# Altium project RK_NVR_DEMO1_RK3588_LP4XD200P232SD8_V21_20211228.PrjPcb (part 1 of 19)
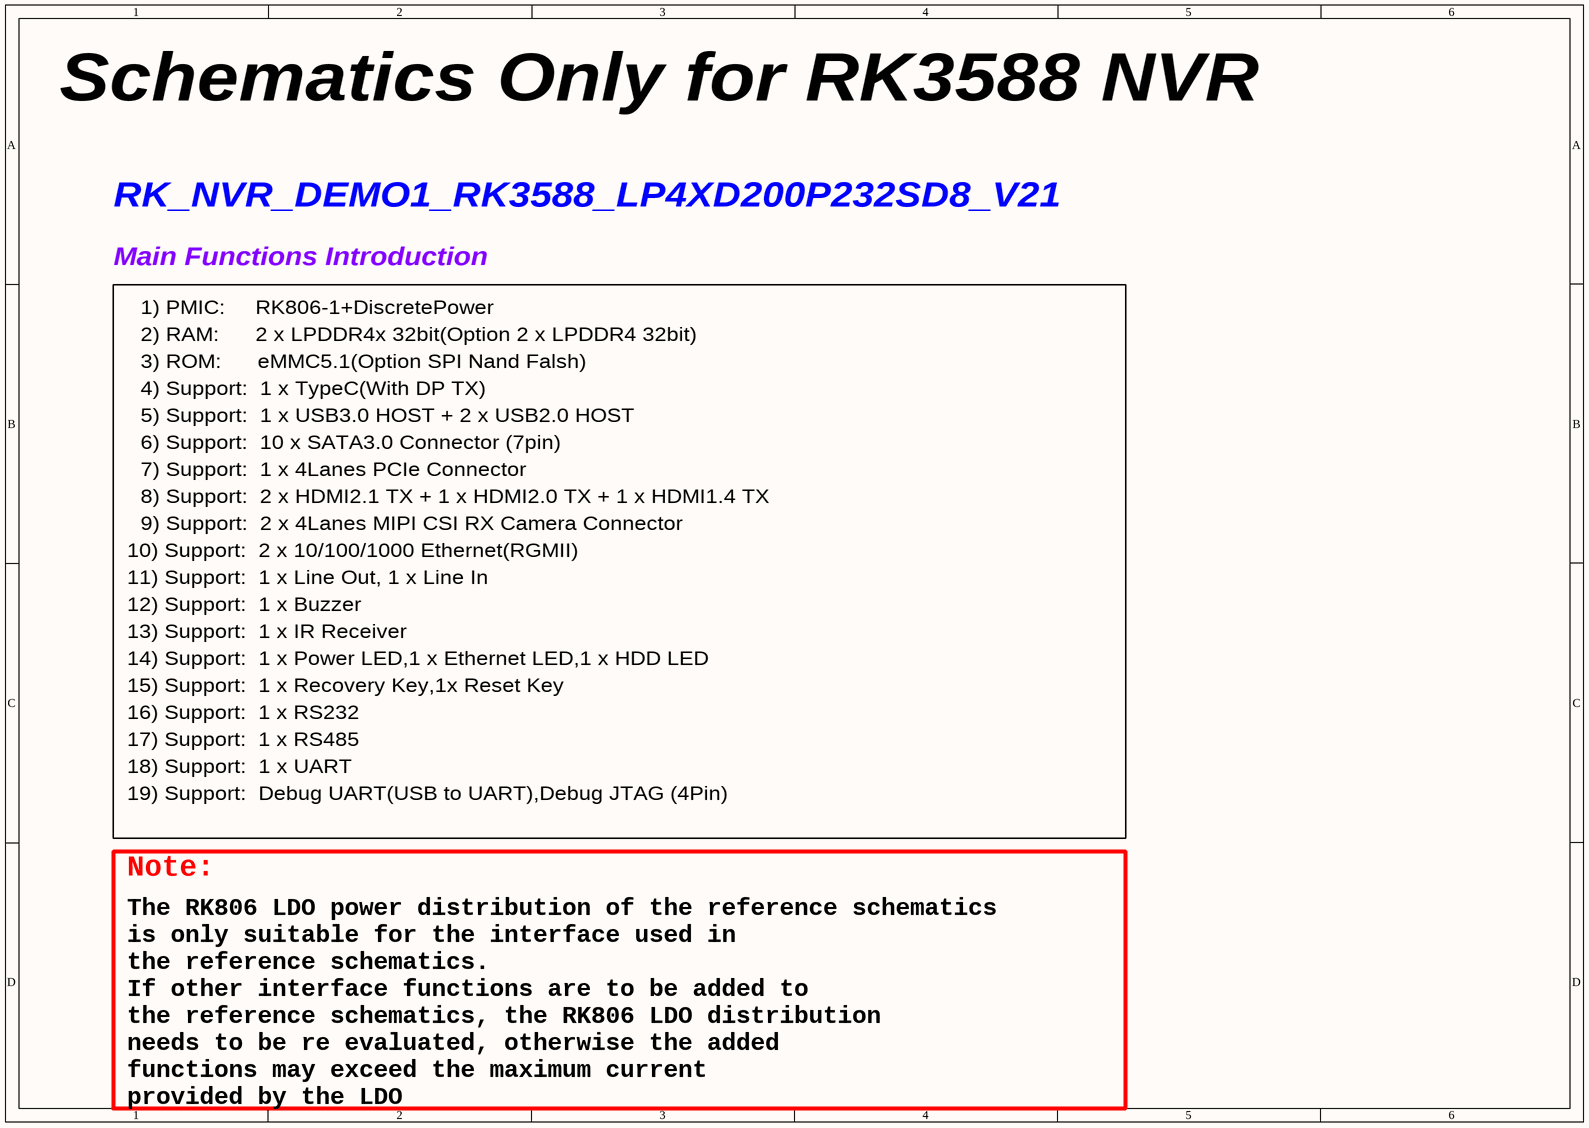
[diagram p0: 00.Cover Page.SchDoc]
42 sheets, 1582 parts. Net scope: global (net labels, ports and power ports of the same name join across sheets).
Board file: RK_NVR_DEMO1_RK3588_LP4XD200P232SD8_V21_20211228_final_lint.PcbDoc
Sheets:
  00.Cover Page.SchDoc
  01.Index and Notes.SchDoc
  02.Revision History.SchDoc
  03.Block Diagram.SchDoc
  04.Power Tree.SchDoc
  05.Power Sequence_IO Domain Map.SchDoc
  06.Lower-Speed Bus Map.SchDoc
  07.USB_DP Configure Map.SchDoc
  08.PCIE Fun Map.SchDoc
  11.RK3588_OSC_PLL_PMUIO.SchDoc
  12.RK3588 DDR Controler.SchDoc
  13.RK3588_Flash_SD Controller.SchDoc
  14.RK3588_USB30_USB20_Ctrl.SchDoc
  15.RK3588_SARADC_1.8V Only GPIO.SchDoc
  16.RK3588_MIPI  Interface.SchDoc
  17.RK3588_HDMI_eDP Interface.SchDoc
  18.RK3588_PCIE30_PCIE20_SATA30.SchDoc
  19.RK3588_1.8V_ 3.3V GPIO.SchDoc
  20.Power_DC IN.SchDoc
  21.Power-PMIC_RK806-1.SchDoc
  22.Power_Ext Discrete_RTC IC.SchDoc
  25.USB2_USB3_TypeC Port.SchDoc
  38.DRAM-LPDDR4X_200P_1X32bit.SchDoc
  40.Flash-eMMC Flash.SchDoc
  43.Flash-SPI FLASH(Option).SchDoc
  47.VI-Camera_MIPI-CSI.SchDoc
  50.VO-HDMI2.1 TX.SchDoc
  51.VO-HDMI2.0 TX(DP to HDMI).SchDoc
  55.VO-HDMI1.4 TX(MIPI to HDMI).SchDoc
  67.Ethernet-GEPHY_RGMII0.SchDoc
  68.Ethernet-GEPHY_RGMII1.SchDoc
  70.Audio Port.SchDoc
  82.SATA-SATA PM0.SchDoc
  83.SATA-SATA PM1.SchDoc
  84.PCIE-PCIE3.0_1x4Lanes_RC_64P.SchDoc
  90.IR Receiver_LED.SchDoc
  91.Debug UART_JTAG.SchDoc
  92.KEY.SchDoc
  93.HW_ID.SchDoc
  95.RS485_RS232.SchDoc
  98.Power Test.SchDoc
  99.Mark_Hole_Heatsink.SchDoc

## Sheet 00.Cover Page.SchDoc
size 297 x 209 mm; Revision: V2.1; Schematic Page Number: 11; Page Number: 1; Check: Default; Schematic Name: RK_NVR_DEMO1_RK3588_LP4/4x_V21; Page Count: 43; Page name: 00.Cover Page; Designer: Zhangdz; Schematic Page Count: 99; Revcode: V2.1; DsnPath: E:\Work\SBER\RK3588_SOM\temp\RK_NVR_DEMO1_RK3588_LP4XD200P232SD8_V21_20211228.DSN; SchematicName: RK_NVR_DEMO1_RK3588_LP4/4x_V21; PageName: 00.Cover Page; PageSize: A4; TopSchematic: True

### Notes on the sheet
- Schematics Only for RK3588 NVR
- RK_NVR_DEMO1_RK3588_LP4XD200P232SD8_V21
- Main Functions Introduction
- 1) PMIC:     RK806-1+DiscretePower
- 2) RAM:      2 x LPDDR4x 32bit(Option 2 x LPDDR4 32bit)
- 3) ROM:      eMMC5.1(Option SPI Nand Falsh)
- 4) Support:  1 x TypeC(With DP TX)
- 5) Support:  1 x USB3.0 HOST + 2 x USB2.0 HOST
- 6) Support:  10 x SATA3.0 Connector (7pin)
- 9) Support:  2 x 4Lanes MIPI CSI RX Camera Connector
- 7) Support:  1 x 4Lanes PCIe Connector
- 8) Support:  2 x HDMI2.1 TX + 1 x HDMI2.0 TX + 1 x HDMI1.4 TX
- 10) Support:  2 x 10/100/1000 Ethernet(RGMII)
- 11) Support:  1 x Line Out, 1 x Line In
- 13) Support:  1 x IR Receiver
- 14) Support:  1 x Power LED,1 x Ethernet LED,1 x HDD LED
- 12) Support:  1 x Buzzer
- 15) Support:  1 x Recovery Key,1x Reset Key
- 16) Support:  1 x RS232
- 19) Support:  Debug UART(USB to UART),Debug JTAG (4Pin)
- 17) Support:  1 x RS485
- 18) Support:  1 x UART
- Note:
- The RK806 LDO power distribution of the reference schematics
  is only suitable for the interface used in
  the reference schematics.
  If other interface functions are to be added to
  the reference schematics, the RK806 LDO distribution
  needs to be re evaluated, otherwise the added
  functions may exceed the maximum current
  provided by the LDO

## Sheet 01.Index and Notes.SchDoc
size 420 x 297 mm; Revision: V2.1; Schematic Page Number: 11; Page Number: 2; Check: Default; Schematic Name: RK_NVR_DEMO1_RK3588_LP4/4x_V21; Page Count: 43; Page name: 01.Index and Notes; Designer: Zhangdz; Schematic Page Count: 99; Revcode: V2.1; DsnPath: E:\Work\SBER\RK3588_SOM\temp\RK_NVR_DEMO1_RK3588_LP4XD200P232SD8_V21_20211228.DSN; SchematicName: RK_NVR_DEMO1_RK3588_LP4/4x_V21; PageName: 01.Index and Notes; PageSize: A3; TopSchematic: True
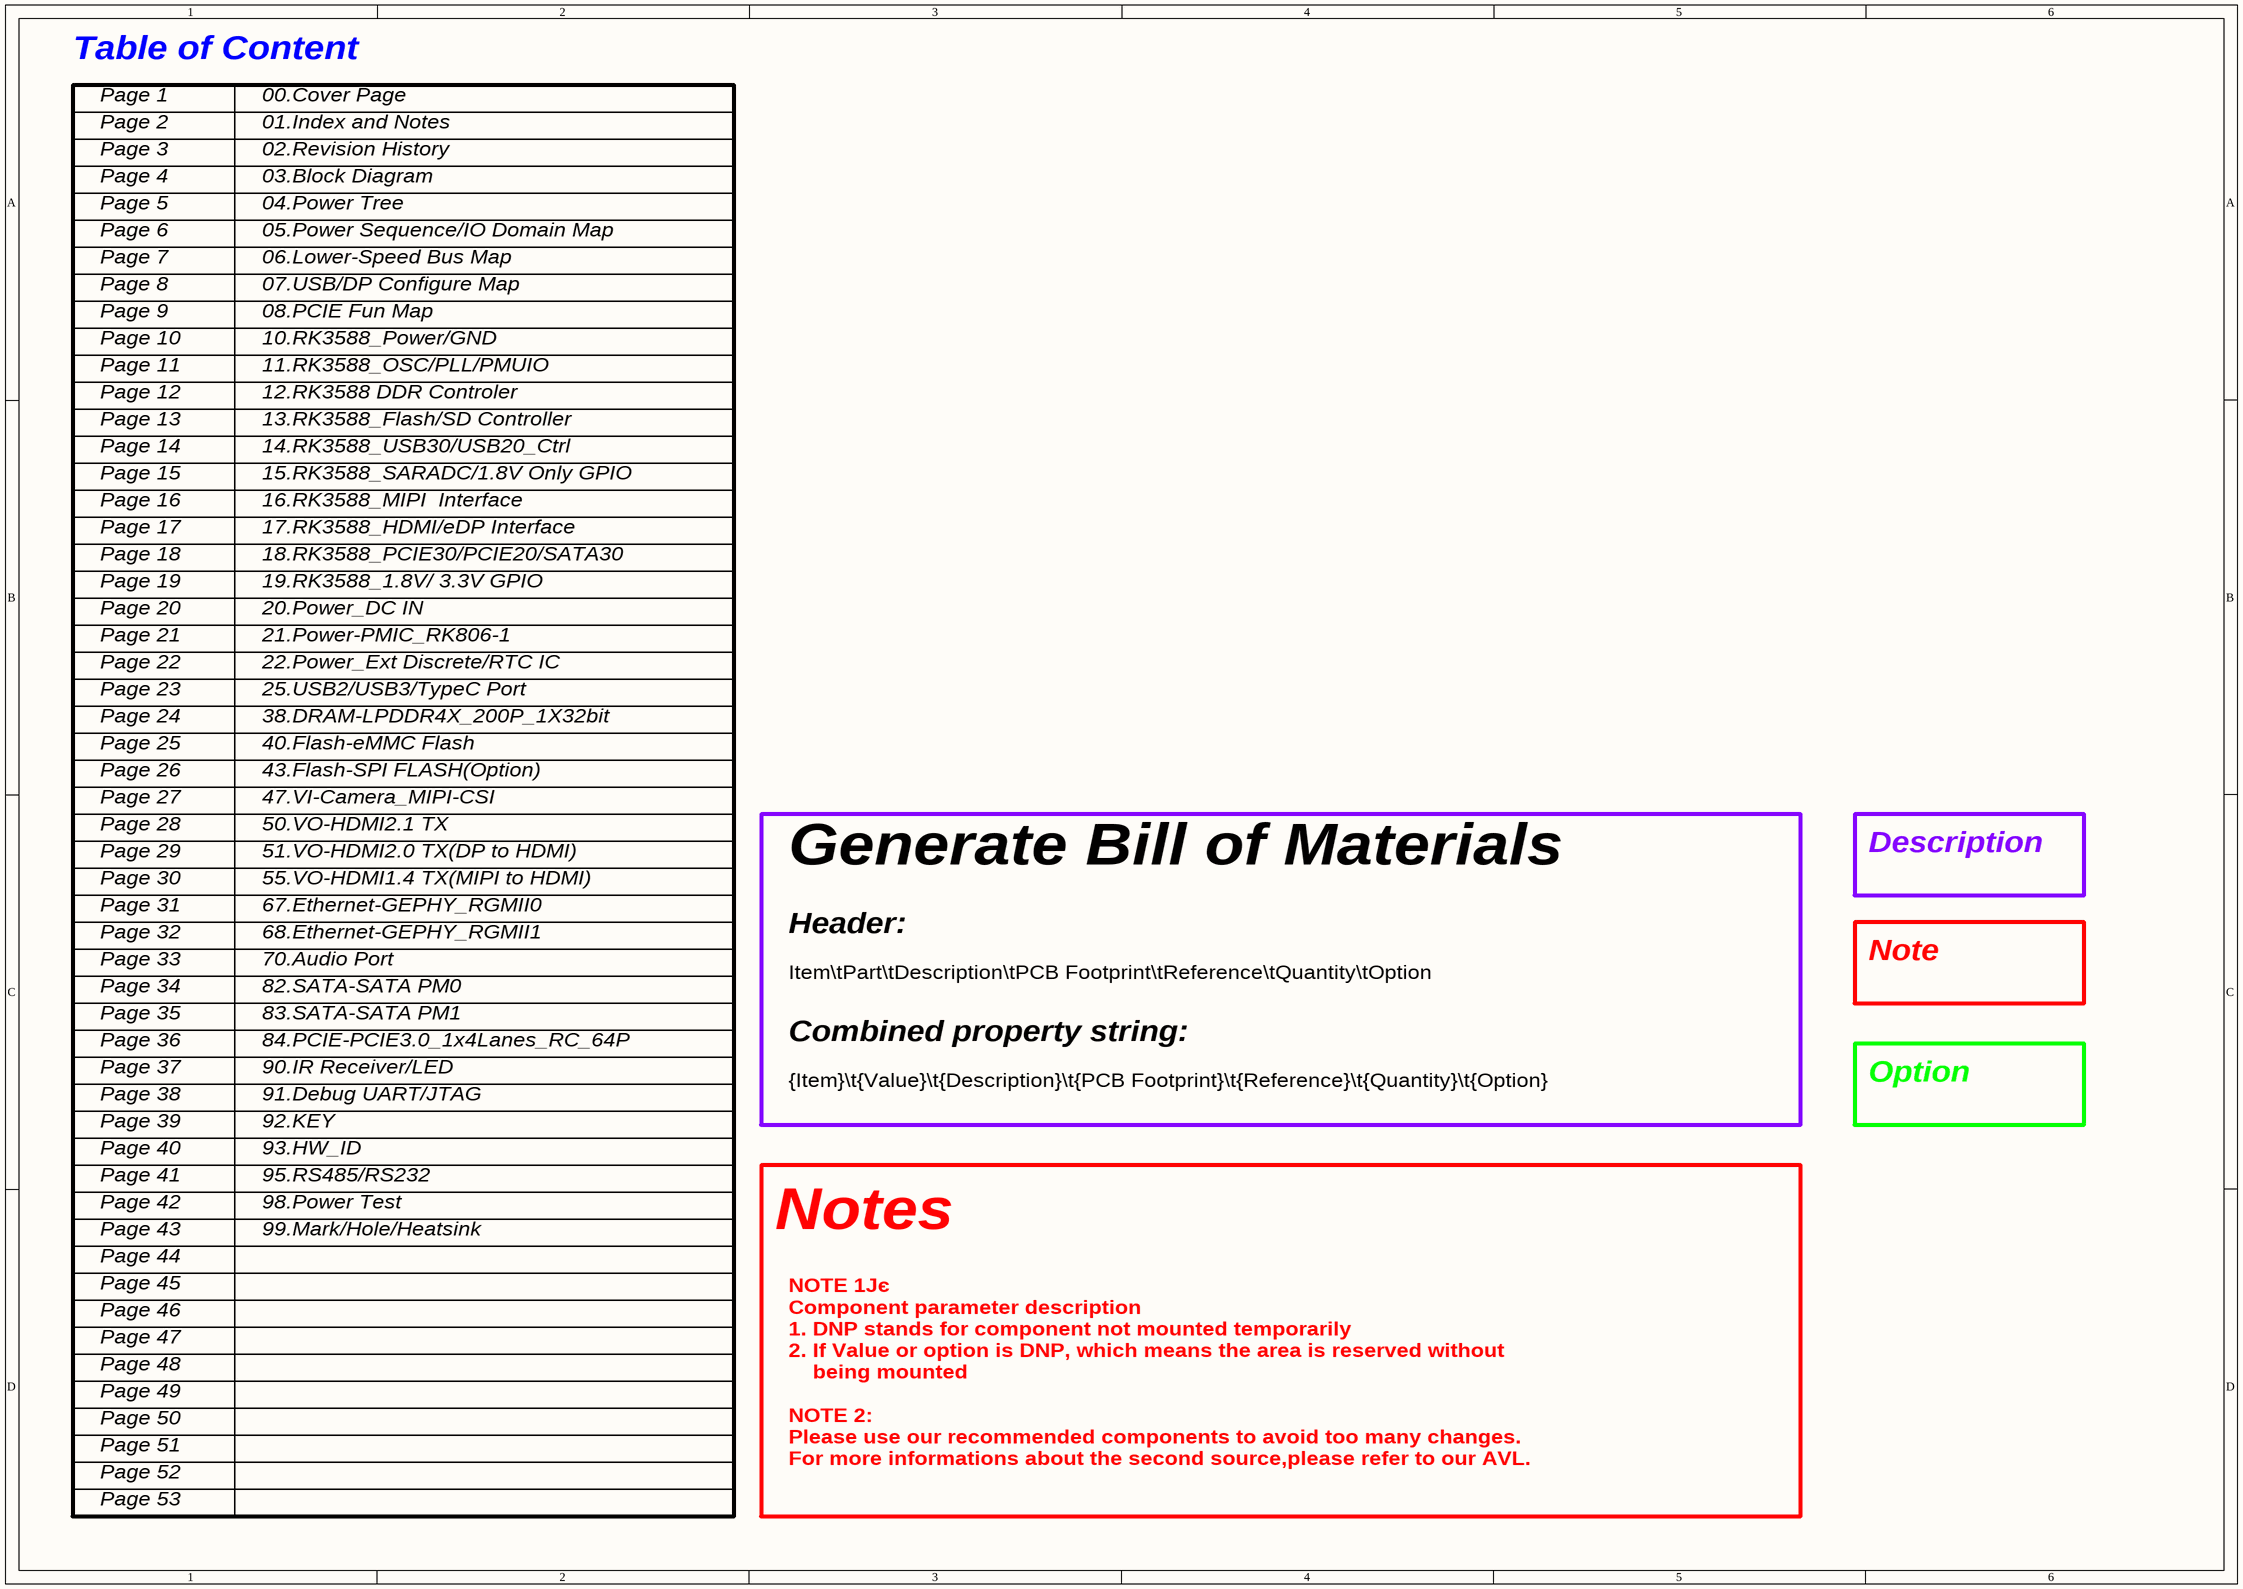
[diagram p1: 01.Index and Notes.SchDoc]

### Notes on the sheet
- Table of Content
- Page 1
- 00.Cover Page
- Page 2
- Page 3
- Page 4
- 01.Index and Notes
- 02.Revision History
- 03.Block Diagram
- Page 5
- Page 6
- 04.Power Tree
- 05.Power Sequence/IO Domain Map
- Page 7
- Page 8
- Page 9
- 06.Lower-Speed Bus Map
- 07.USB/DP Configure Map
- 08.PCIE Fun Map
- Page 10
- Page 11
- 10.RK3588_Power/GND
- 11.RK3588_OSC/PLL/PMUIO
- Page 12
- Page 13
- Page 14
- 13.RK3588_Flash/SD Controller
- 12.RK3588 DDR Controler
- 14.RK3588_USB30/USB20_Ctrl
- Page 15
- Page 16
- 15.RK3588_SARADC/1.8V Only GPIO
- 16.RK3588_MIPI  Interface
- Page 17
- Page 18
- Page 19
- 17.RK3588_HDMI/eDP Interface
- 18.RK3588_PCIE30/PCIE20/SATA30
- 19.RK3588_1.8V/ 3.3V GPIO
- Page 20
- Page 21
- 20.Power_DC IN
- 21.Power-PMIC_RK806-1
- Page 22
- Page 23
- Page 24
- 25.USB2/USB3/TypeC Port
- 38.DRAM-LPDDR4X_200P_1X32bit
- 22.Power_Ext Discrete/RTC IC
- Page 25
- Page 26
- 40.Flash-eMMC Flash
- 43.Flash-SPI FLASH(Option)
- Page 27
- Page 28
- Page 29
- 47.VI-Camera_MIPI-CSI
- 50.VO-HDMI2.1 TX
- 51.VO-HDMI2.0 TX(DP to HDMI)
- Description
- Page 30
- Page 31
- 55.VO-HDMI1.4 TX(MIPI to HDMI)
- 67.Ethernet-GEPHY_RGMII0
- Header:
- Generate Bill of Materials
- Page 32
- Page 33
- Page 34
- 70.Audio Port
- 68.Ethernet-GEPHY_RGMII1
- 82.SATA-SATA PM0
- Item\tPart\tDescription\tPCB Footprint\tReference\tQuantity\tOption
- Note
- Page 35
- Page 36
- 83.SATA-SATA PM1
- 84.PCIE-PCIE3.0_1x4Lanes_RC_64P
- Combined property string:
- Page 37
- Page 38
- Page 39
- 90.IR Receiver/LED
- 91.Debug UART/JTAG
- 92.KEY
- {Item}\t{Value}\t{Description}\t{PCB Footprint}\t{Reference}\t{Quantity}\t{Option}
- Option
- Page 40
- Page 41
- 95.RS485/RS232
- 93.HW_ID
- Page 42
- Page 43
- Page 44
- 99.Mark/Hole/Heatsink
- 98.Power Test
- Notes
- Page 45
- Page 46
- Page 47
- Page 48
- Page 49
- Page 50
- Page 51
- NOTE 1Јє
  Component parameter description
  1. DNP stands for component not mounted temporarily
  2. If Value or option is DNP, which means the area is reserved without
  being mounted
  NOTE 2:
  Please use our recommended components to avoid too many changes.
  For more informations about the second source,please refer to our AVL.
- Page 52
- Page 53

## Sheet 02.Revision History.SchDoc
size 297 x 209 mm; Revision: V2.1; Schematic Page Number: 11; Page Number: 3; Check: Default; Schematic Name: RK_NVR_DEMO1_RK3588_LP4/4x_V21; Page Count: 43; Page name: 02.Revision History; Designer: Zhangdz; Schematic Page Count: 99; Revcode: V2.1; DsnPath: E:\Work\SBER\RK3588_SOM\temp\RK_NVR_DEMO1_RK3588_LP4XD200P232SD8_V21_20211228.DSN; SchematicName: RK_NVR_DEMO1_RK3588_LP4/4x_V21; PageName: 02.Revision History; PageSize: A4; TopSchematic: True
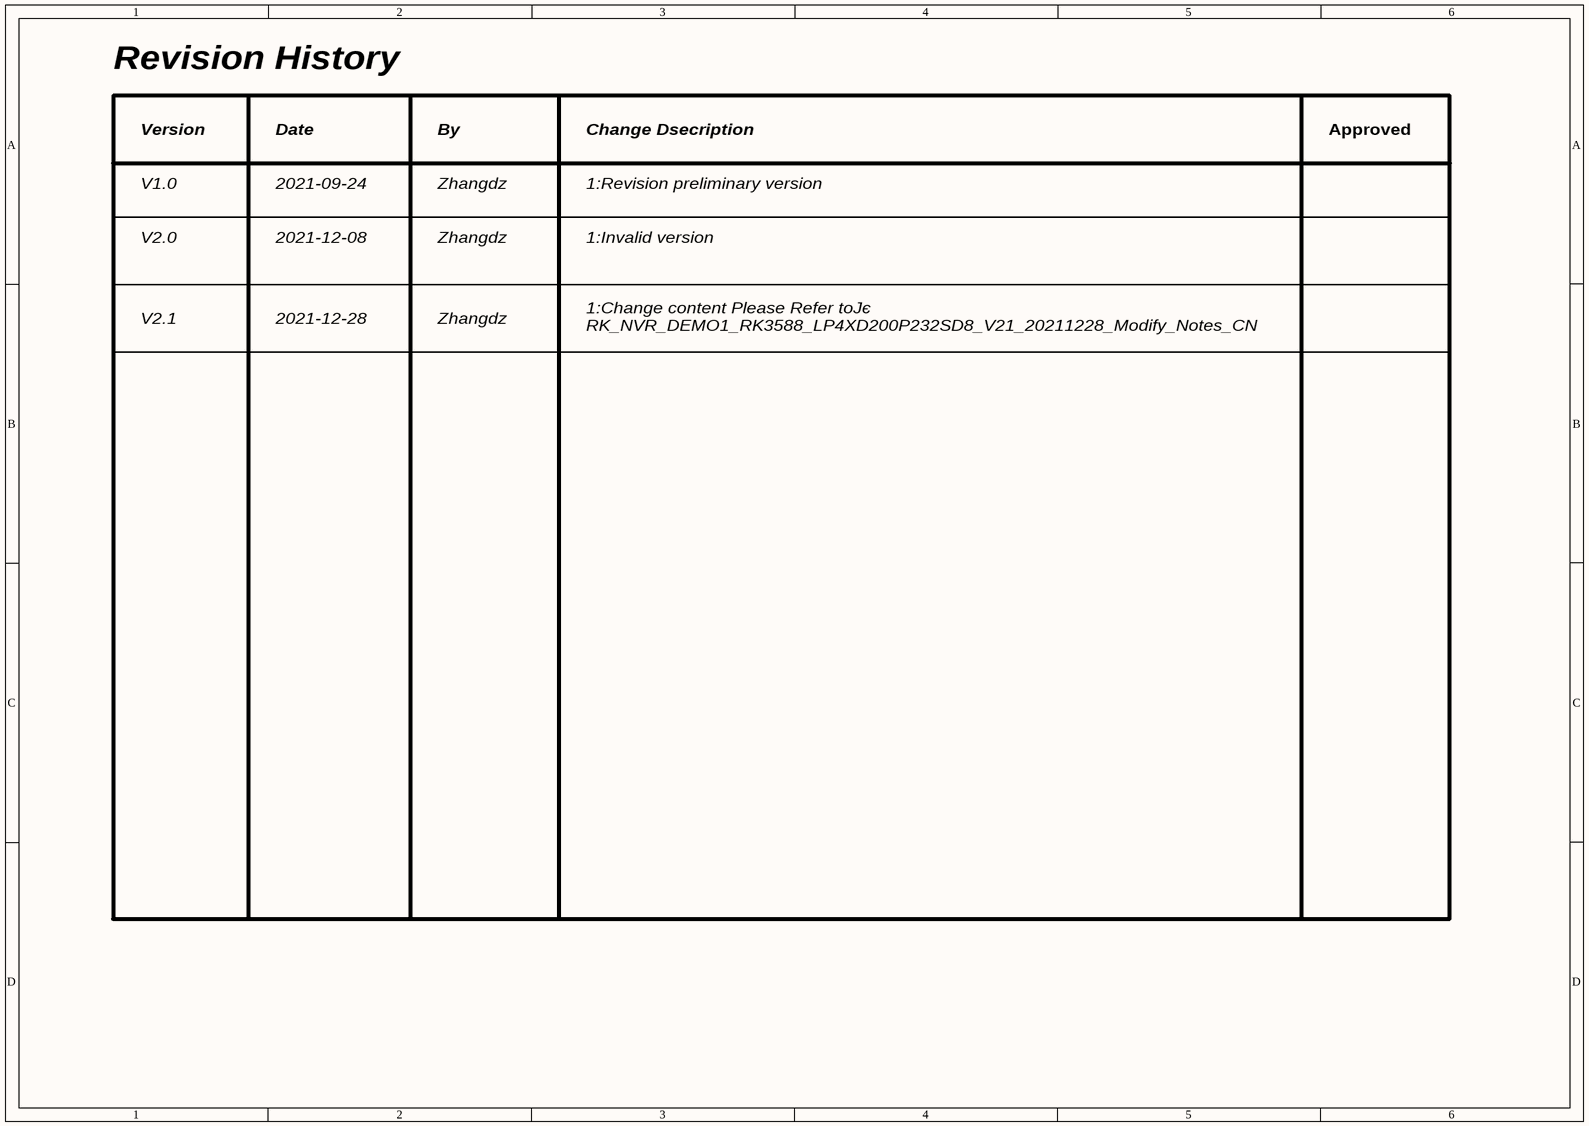
[diagram p2: 02.Revision History.SchDoc]

### Notes on the sheet
- Revision History
- Version
- Date
- By
- Change Dsecription
- Approved
- V1.0
- 2021-09-24
- Zhangdz
- 1:Revision preliminary version
- V2.0
- 2021-12-08
- 1:Invalid version
- V2.1
- 2021-12-28
- 1:Change content Please Refer toЈє
  RK_NVR_DEMO1_RK3588_LP4XD200P232SD8_V21_20211228_Modify_Notes_CN

## Sheet 03.Block Diagram.SchDoc
size 594 x 420 mm; Revision: V2.1; Schematic Page Number: 11; Page Number: 4; Check: Default; Schematic Name: RK_NVR_DEMO1_RK3588_LP4/4x_V21; Page Count: 43; Page name: 03.Block Diagram; Designer: Zhangdz; Schematic Page Count: 99; Revcode: V2.1; DsnPath: E:\Work\SBER\RK3588_SOM\temp\RK_NVR_DEMO1_RK3588_LP4XD200P232SD8_V21_20211228.DSN; SchematicName: RK_NVR_DEMO1_RK3588_LP4/4x_V21; PageName: 03.Block Diagram; PageSize: A2; TopSchematic: True
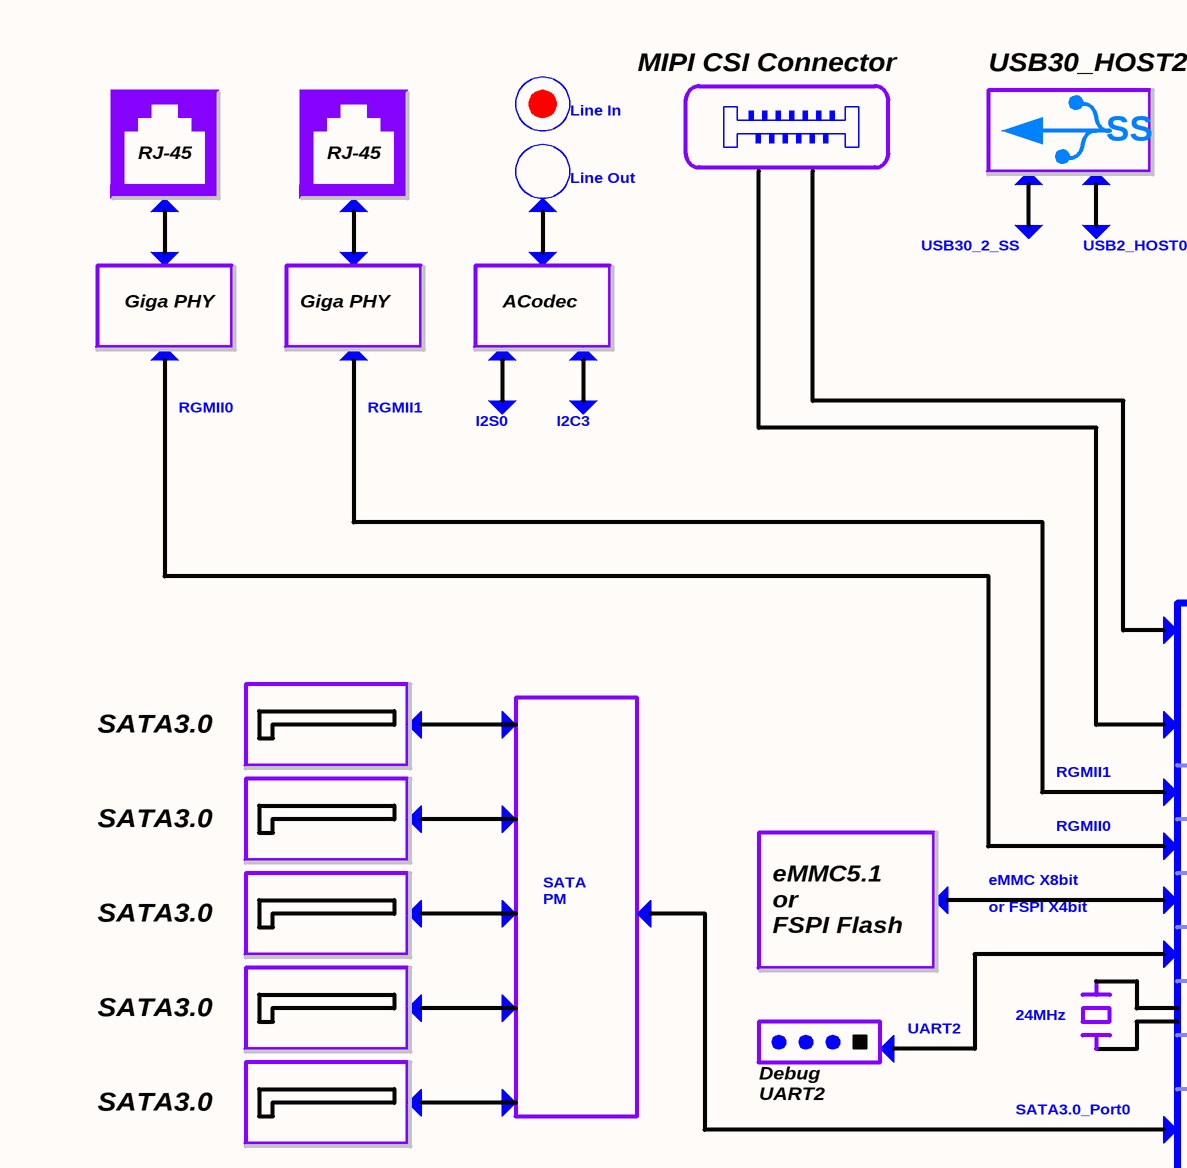
[diagram p3: 03.Block Diagram.SchDoc, top left]
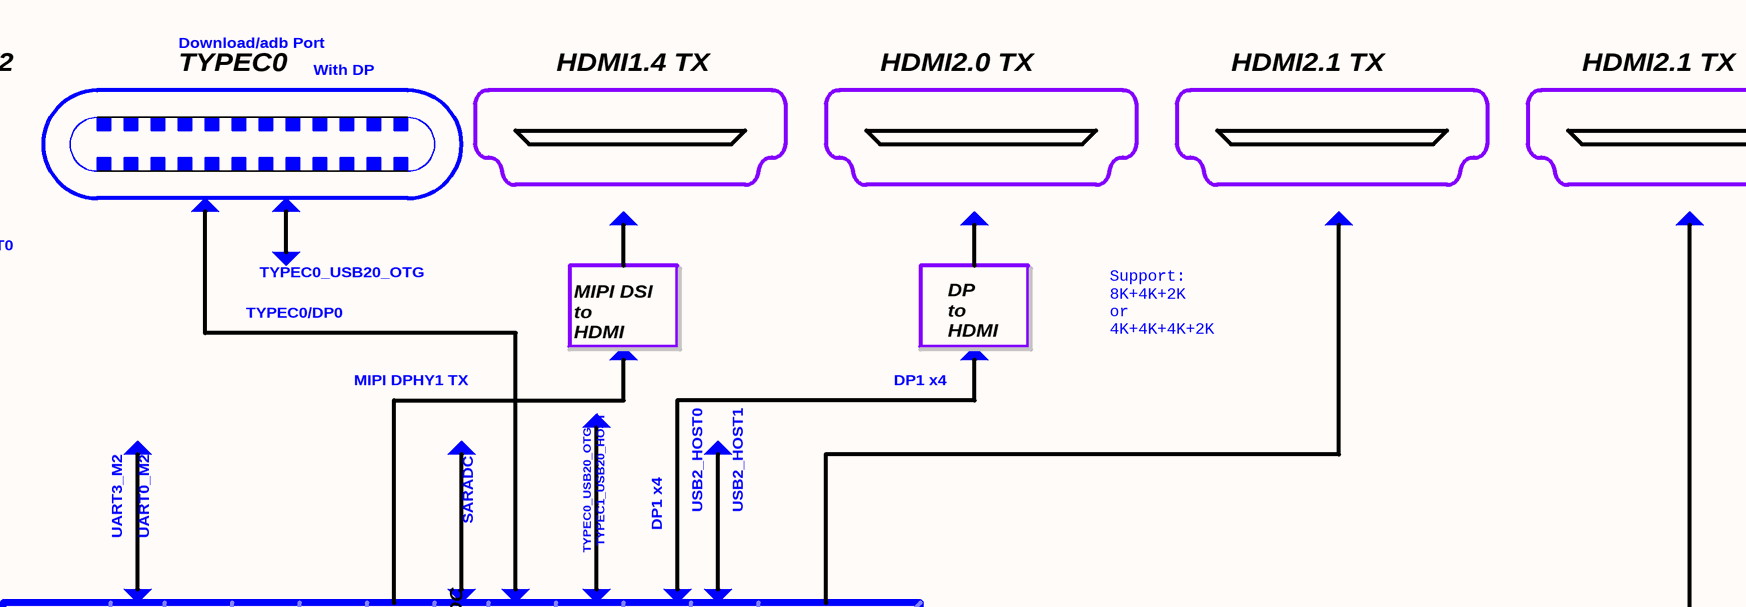
[diagram p4: 03.Block Diagram.SchDoc, top right]
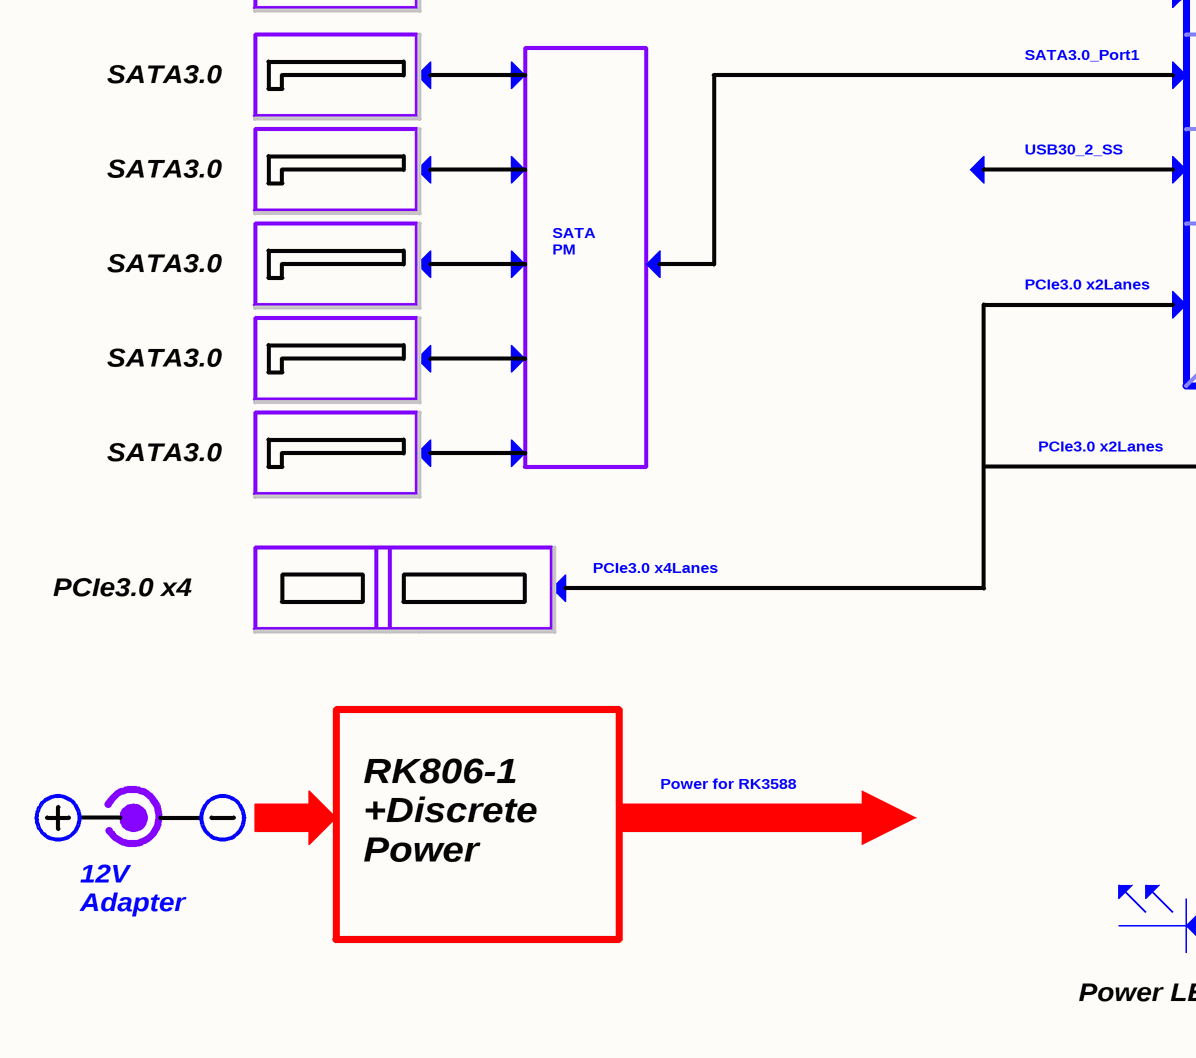
[diagram p5: 03.Block Diagram.SchDoc, bottom left]
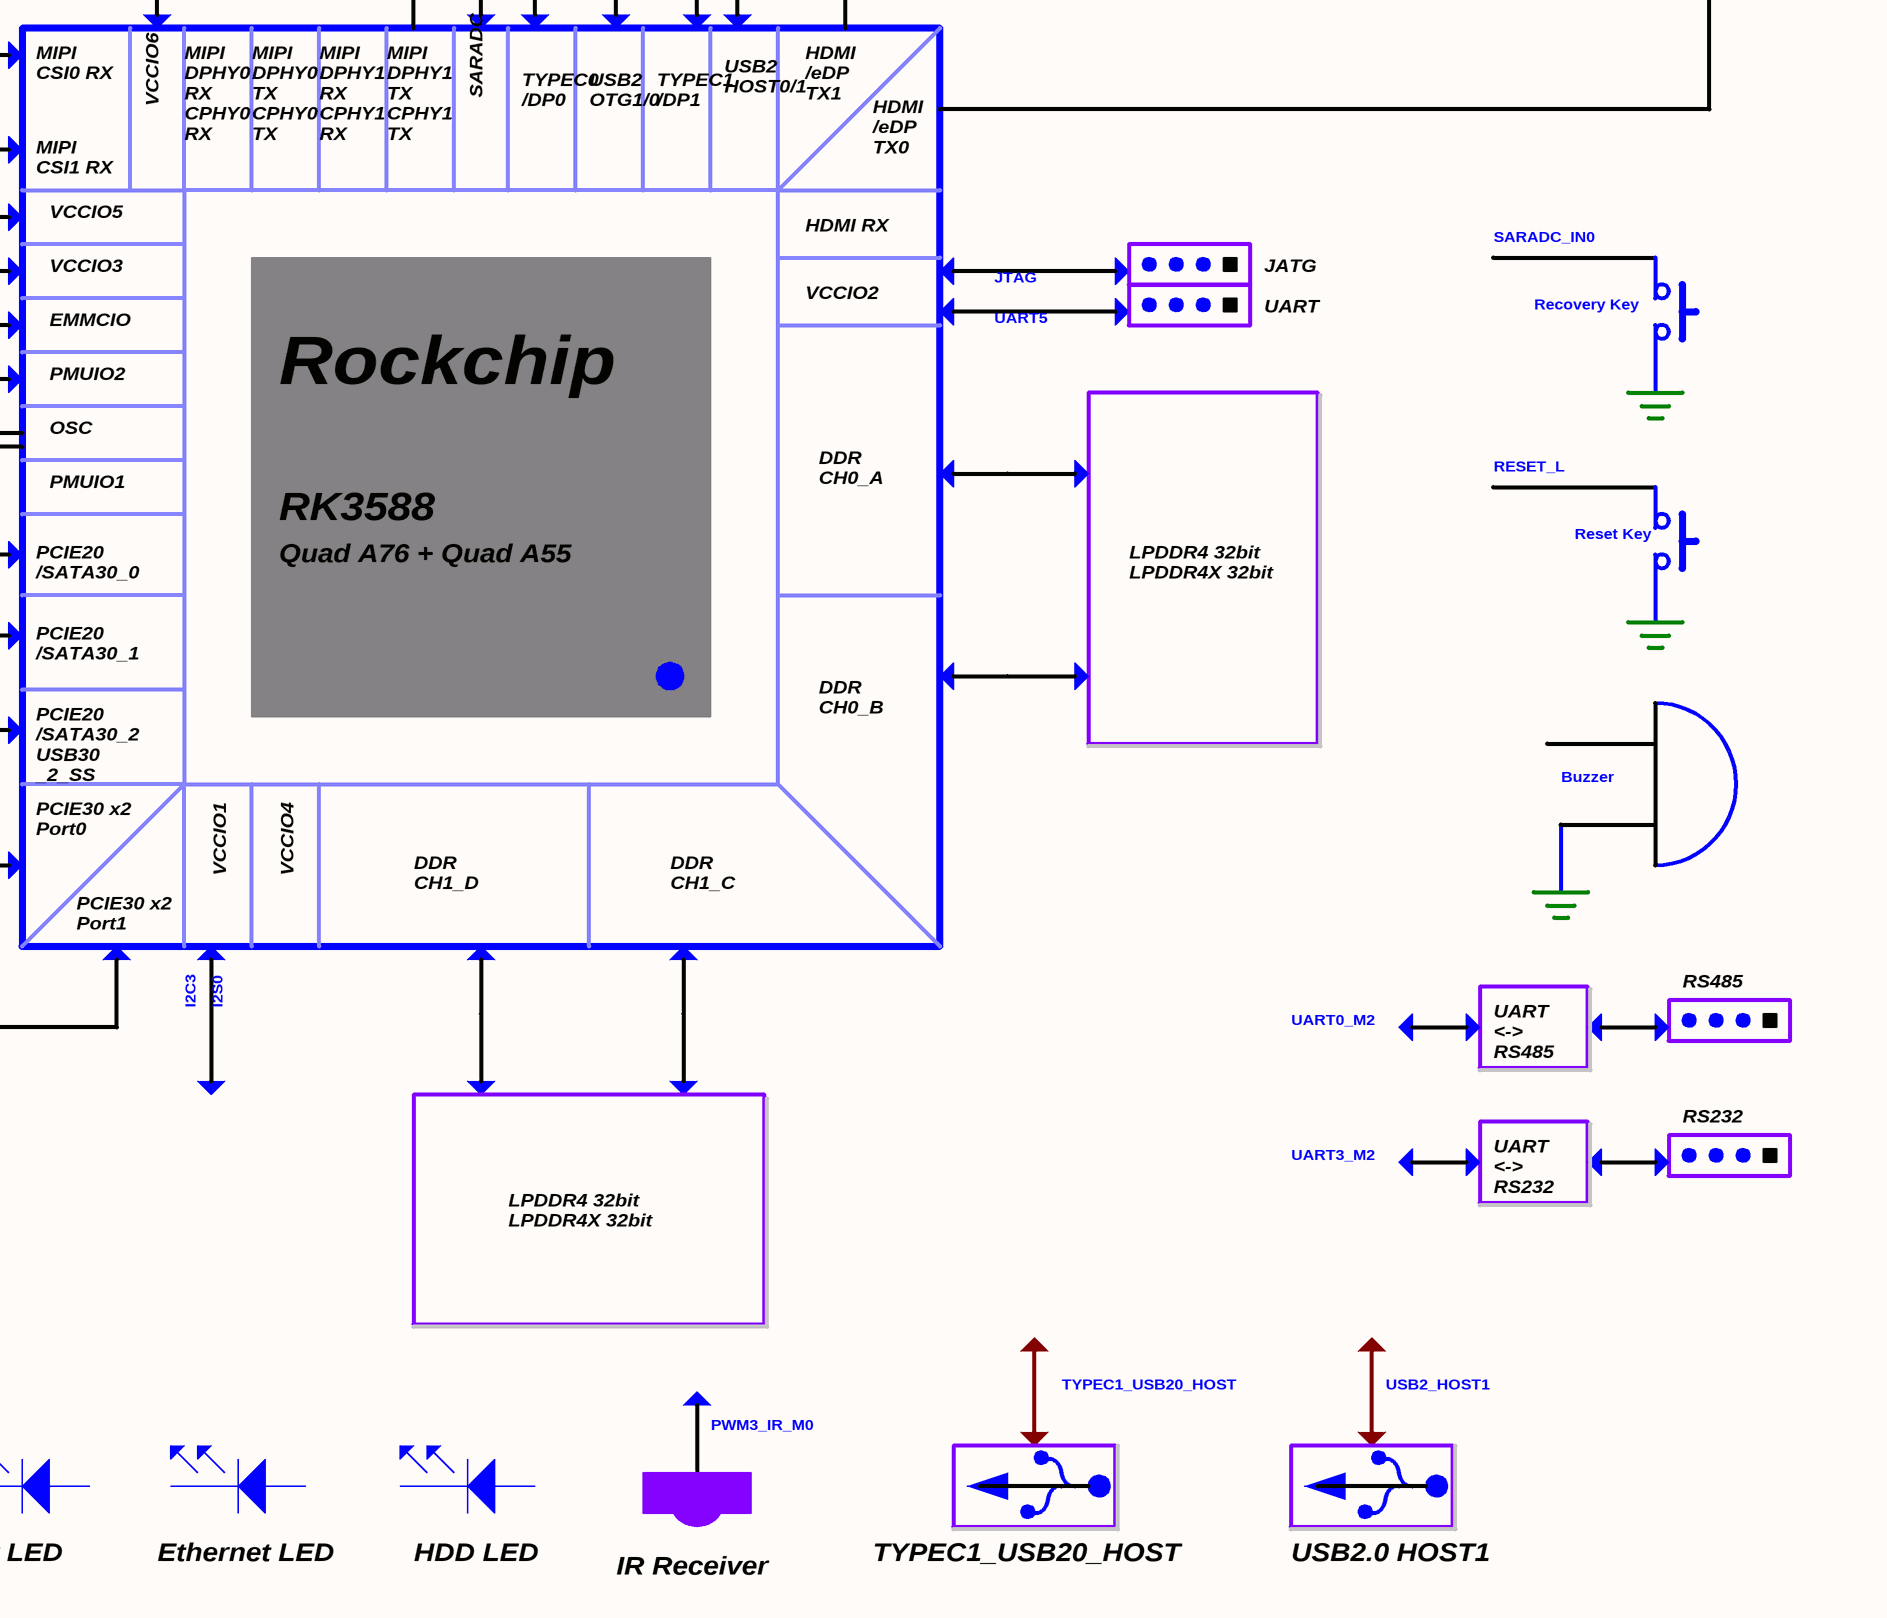
[diagram p6: 03.Block Diagram.SchDoc, bottom right]

### Notes on the sheet
- MIPI CSI Connector
- USB30_HOST2
- TYPEC0
- Download/adb Port
- With DP
- HDMI1.4 TX
- HDMI2.0 TX
- HDMI2.1 TX
- Line In
- SS
- RJ-45
- Line Out
- USB30_2_SS
- USB2_HOST0
- TYPEC0_USB20_OTG
- Giga PHY
- ACodec
- TYPEC0/DP0
- MIPI DSI
  to
  HDMI
- DP
  to
  HDMI
- Support:
  8K+4K+2K
  or
  4K+4K+4K+2K
- RGMII0
- RGMII1
- MIPI DPHY1 TX
- DP1 x4
- I2S0
- I2C3
- UART3_M2
- UART0_M2
- SARADC
- TYPEC1_USB20_HOST
- USB2_HOST1
- MIPI
  CSI0 RX
- VCCIO6
- HDMI
  /eDP
  TX1
- SATA3.0
- MIPI
  CSI1 RX
- MIPI
  DPHY0 RX
  CPHY0 RX
- MIPI
  DPHY0 TX
  CPHY0 TX
- MIPI
  DPHY1 RX
  CPHY1 RX
- MIPI
  DPHY1 TX
  CPHY1 TX
- TYPEC0
  /DP0
- USB2
  OTG1/0
- TYPEC1
  /DP1
- USB2
  HOST0/1
- HDMI
  /eDP
  TX0
- VCCIO5
- HDMI RX
- SARADC_IN0
- eMMC X8bit
- VCCIO3
- VCCIO2
- JTAG
- UART
- JATG
- Recovery Key
- SATA
  PM
- eMMC5.1
  or
  FSPI Flash
- or FSPI X4bit
- EMMCIO
- UART5
- 24MHz
- PMUIO2
- OSC
- Rockchip
- UART2
- PMUIO1
- DDR
  CH0_A
- RESET_L
- Debug
  UART2
- SATA3.0_Port0
- PCIE20
  /SATA30_0
- RK3588
- Quad A76 + Quad A55
- LPDDR4 32bit
  LPDDR4X 32bit
- Reset Key
- SATA3.0_Port1
- PCIE20
  /SATA30_1
- DDR
  CH0_B
- PCIE20
  /SATA30_2
  USB30
  _2_SS
- Buzzer
- PCIe3.0 x2Lanes
- PCIE30 x2
  Port0
- VCCIO1
- VCCIO4
- DDR
  CH1_D
- DDR
  CH1_C
- PCIE30 x2
  Port1
- RS485
- UART
  <->
  RS485
- RS232
- PCIe3.0 x4
- PCIe3.0 x4Lanes
- UART
  <->
  RS232
- Power for RK3588
- RK806-1
  +Discrete
  Power
- PWM3_IR_M0
- 12V
  Adapter
- Power LED
- Ethernet LED
- HDD LED
- IR Receiver
- USB2.0 HOST1

## Sheet 04.Power Tree.SchDoc
size 594 x 420 mm; Revision: V2.1; Schematic Page Number: 11; Page Number: 5; Check: Default; Schematic Name: RK_NVR_DEMO1_RK3588_LP4/4x_V21; Page Count: 43; Page name: 04.Power Tree; Designer: Zhangdz; Schematic Page Count: 99; Revcode: V2.1; DsnPath: E:\Work\SBER\RK3588_SOM\temp\RK_NVR_DEMO1_RK3588_LP4XD200P232SD8_V21_20211228.DSN; SchematicName: RK_NVR_DEMO1_RK3588_LP4/4x_V21; PageName: 04.Power Tree; PageSize: A2; TopSchematic: True
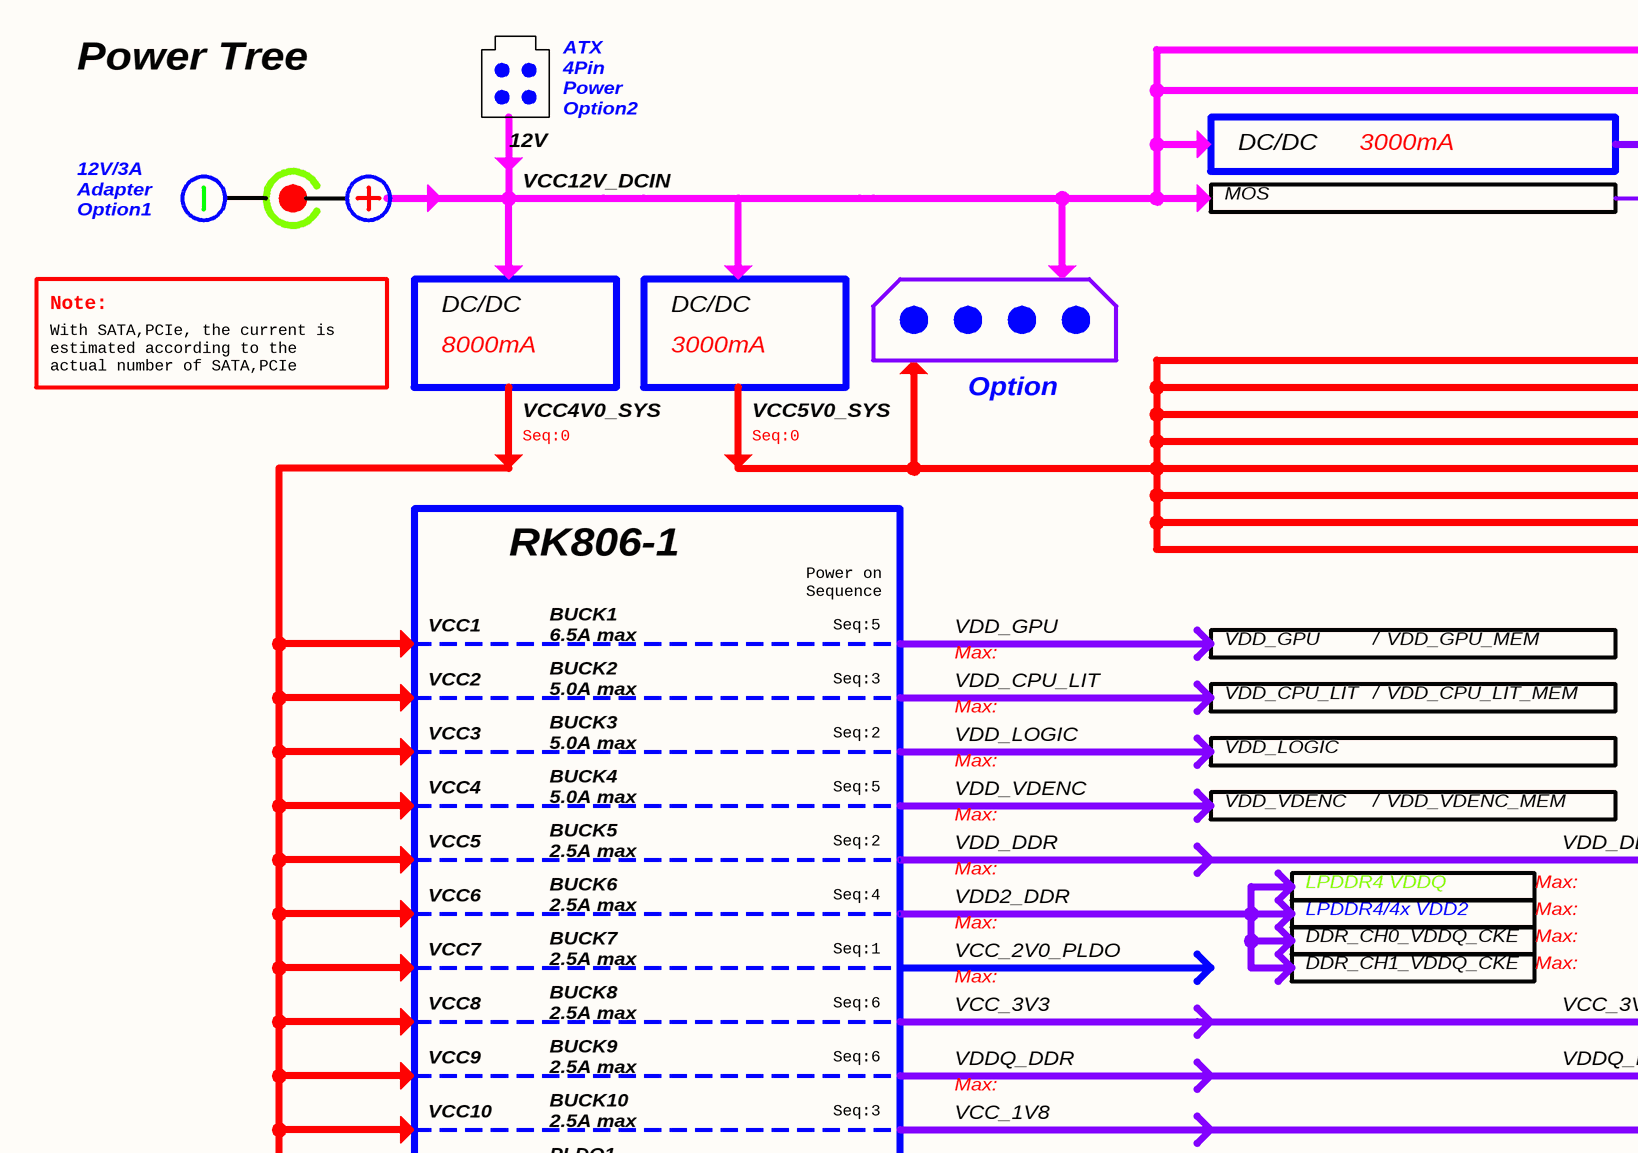
[diagram p7: 04.Power Tree.SchDoc, top left]
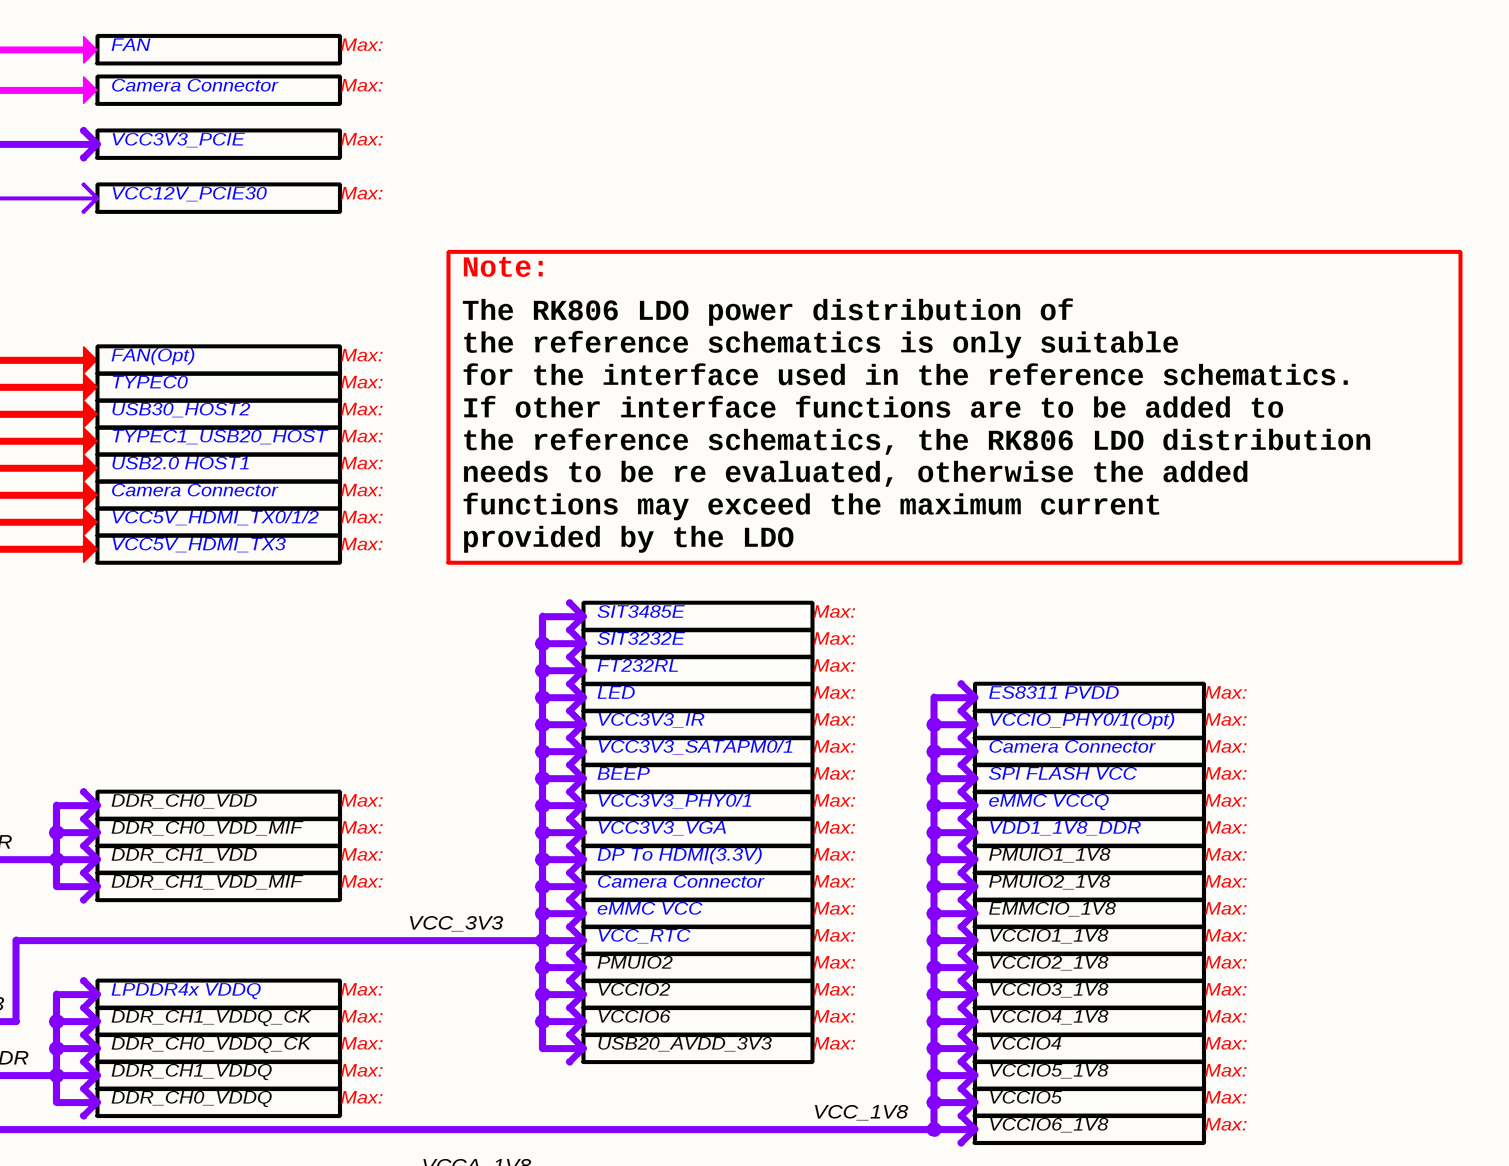
[diagram p8: 04.Power Tree.SchDoc, top right]
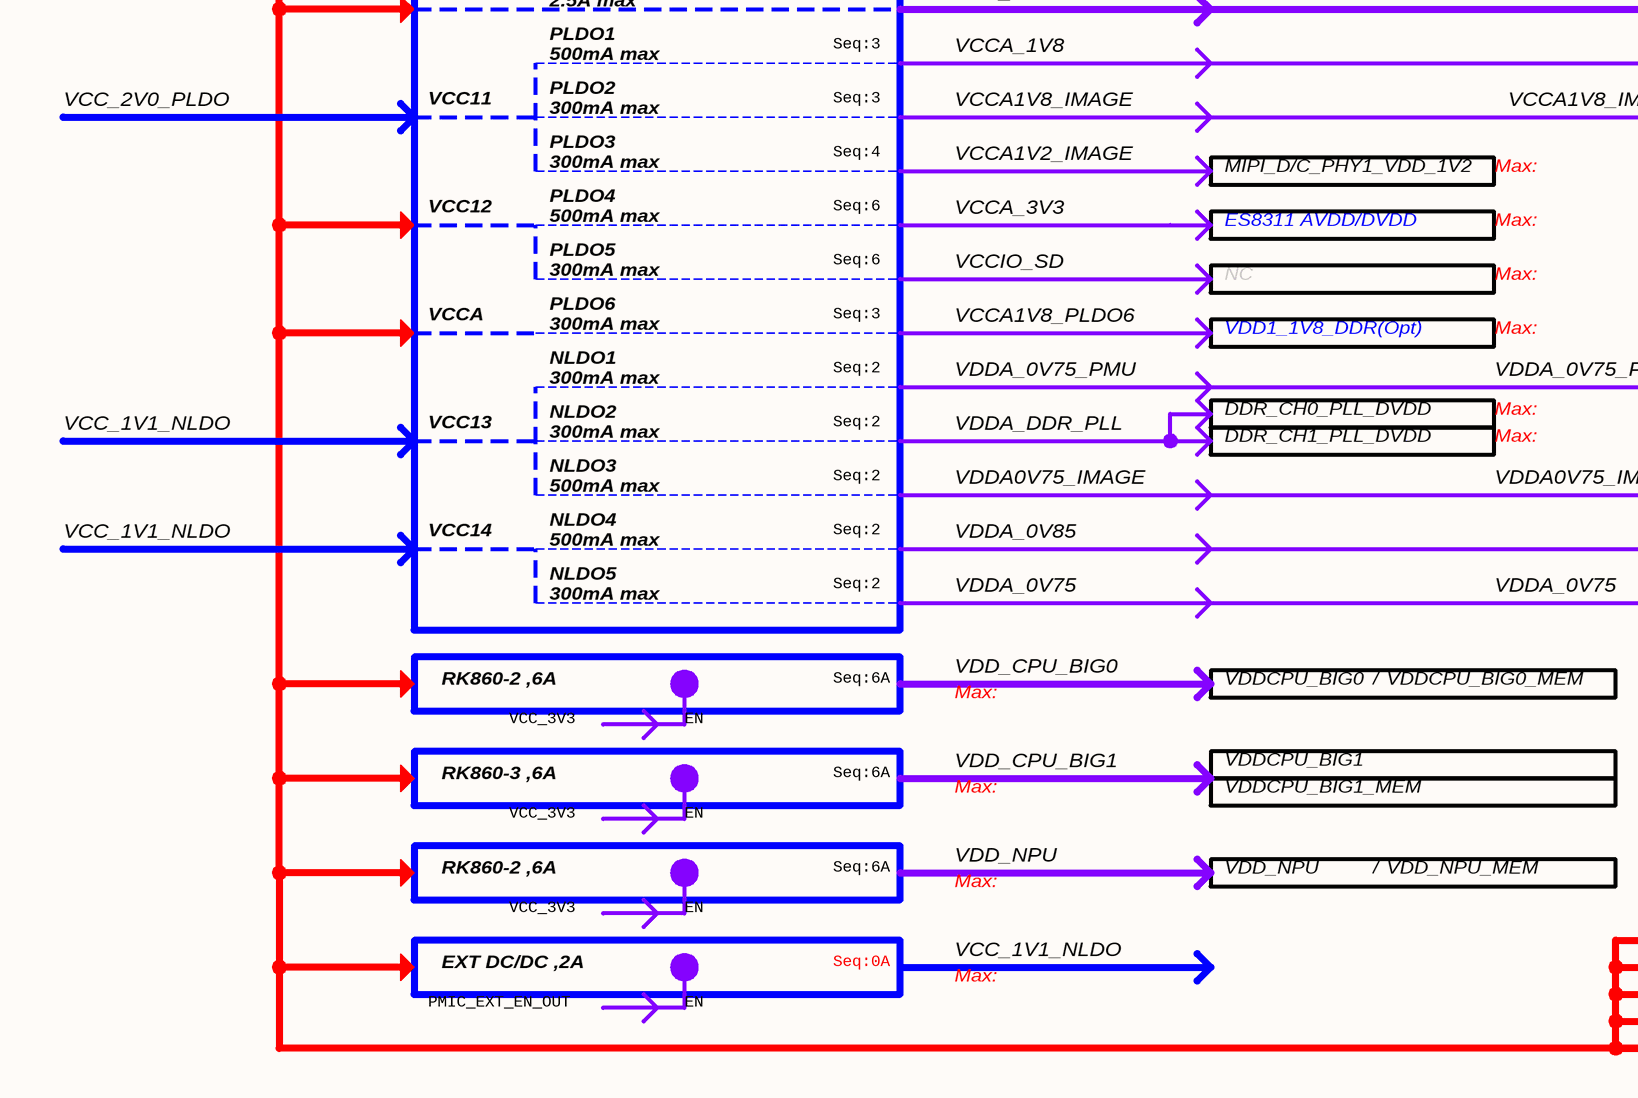
[diagram p9: 04.Power Tree.SchDoc, bottom left]
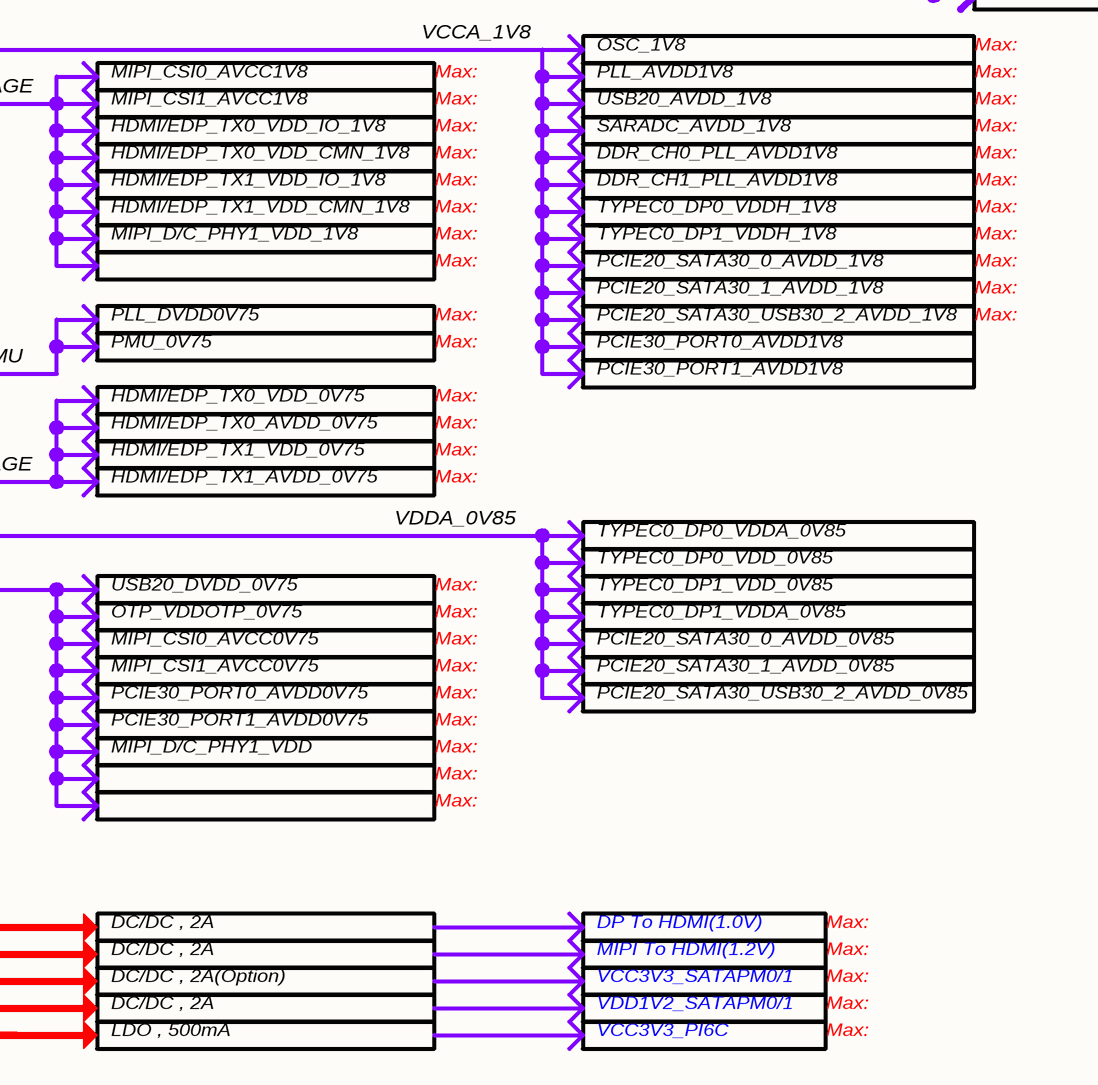
[diagram p10: 04.Power Tree.SchDoc, bottom right]

### Notes on the sheet
- Power Tree
- Camera Connector
- FAN
- Max:
- 12V
- ATX
  4Pin
  Power
  Option2
- DC/DC
- 3000mA
- VCC3V3_PCIE
- 12V/3A
  Adapter
  Option1
- VCC12V_DCIN
- MOS
- VCC12V_PCIE30
- Note:
- 8000mA
- FAN(Opt)
- With SATA,PCIe, the current is
  estimated according to the
  actual number of SATA,PCIe
- VCC4V0_SYS
- VCC5V0_SYS
- Option
- USB30_HOST2
- TYPEC0
- Seq:0
- USB2.0 HOST1
- TYPEC1_USB20_HOST
- RK806-1
- VCC5V_HDMI_TX0/1/2
- VCC5V_HDMI_TX3
- The RK806 LDO power distribution of
  the reference schematics is only suitable
  for the interface used in the reference schematics.
  If other interface functions are to be added to
  the reference schematics, the RK806 LDO distribution
  needs to be re evaluated, otherwise the added
  functions may exceed the maximum current
  provided by the LDO
- VCC1
- Power on
  Sequence
- Seq:5
- SIT3485E
- VCC2
- BUCK1
  6.5A max
- BUCK2
  5.0A max
- Seq:3
- VDD_CPU_LIT
- VDD_GPU
- /
- VDD_GPU_MEM
- FT232RL
- SIT3232E
- VCC3
- BUCK3
  5.0A max
- Seq:2
- VDD_LOGIC
- VDD_CPU_LIT_MEM
- VCC3V3_SATAPM0/1
- VCC3V3_IR
- LED
- VCCIO_PHY0/1(Opt)
- ES8311 PVDD
- VCC4
- BUCK4
  5.0A max
- VDD_VDENC
- VDD_VDENC_MEM
- DDR_CH0_VDD
- VCC3V3_PHY0/1
- BEEP
- eMMC VCCQ
- SPI FLASH VCC
- VCC5
- VCC6
- BUCK5
  2.5A max
- Seq:4
- VDD_DDR
- LPDDR4 VDDQ
- DDR_CH0_VDD_MIF
- DDR_CH1_VDD_MIF
- DDR_CH1_VDD
- DP To HDMI(3.3V)
- VCC3V3_VGA
- VDD1_1V8_DDR
- PMUIO1_1V8
- PMUIO2_1V8
- VCC7
- BUCK7
  2.5A max
- BUCK6
  2.5A max
- Seq:1
- VDD2_DDR
- VCC_2V0_PLDO
- DDR_CH0_VDDQ_CKE
- LPDDR4/4x VDD2
- VCC_3V3
- VCC_RTC
- eMMC VCC
- EMMCIO_1V8
- VCCIO1_1V8
- VCC8
- BUCK8
  2.5A max
- Seq:6
- DDR_CH1_VDDQ_CKE
- DDR_CH1_VDDQ_CK
- LPDDR4x VDDQ
- PMUIO2
- VCCIO2
- VCCIO6
- VCCIO2_1V8
- VCCIO3_1V8
- VCCIO4_1V8
- VCC9
- BUCK9
  2.5A max
- VDDQ_DDR
- DDR_CH0_VDDQ_CK
- DDR_CH1_VDDQ
- USB20_AVDD_3V3
- VCCIO5_1V8
- VCCIO4
- VCC10
- BUCK10
  2.5A max
- VCC_1V8
- DDR_CH0_VDDQ
- VCCIO5
- VCCIO6_1V8
- VCC11
- PLDO1
  500mA max
- PLDO2
  300mA max
- VCCA_1V8
- VCCA1V8_IMAGE
- MIPI_CSI0_AVCC1V8
- OSC_1V8
- PLL_AVDD1V8
- PLDO3
  300mA max
- VCCA1V2_IMAGE
- MIPI_D/C_PHY1_VDD_1V2
- MIPI_CSI1_AVCC1V8
- HDMI/EDP_TX0_VDD_IO_1V8
- HDMI/EDP_TX0_VDD_CMN_1V8
- DDR_CH0_PLL_AVDD1V8
- USB20_AVDD_1V8
- SARADC_AVDD_1V8
- VCC12
- PLDO4
  500mA max
- VCCA_3V3
- ES8311 AVDD/DVDD
- HDMI/EDP_TX1_VDD_IO_1V8
- HDMI/EDP_TX1_VDD_CMN_1V8
- DDR_CH1_PLL_AVDD1V8
- TYPEC0_DP0_VDDH_1V8
- VCCA
- PLDO5
  300mA max
- VCCIO_SD
- NC
- MIPI_D/C_PHY1_VDD_1V8
- TYPEC0_DP1_VDDH_1V8
- PCIE20_SATA30_0_AVDD_1V8
- PCIE20_SATA30_1_AVDD_1V8
- PLDO6
  300mA max
- NLDO1
  300mA max
- VDDA_0V75_PMU
- VCCA1V8_PLDO6
- VDD1_1V8_DDR(Opt)
- PLL_DVDD0V75
- PMU_0V75
- PCIE20_SATA30_USB30_2_AVDD_1V8
- PCIE30_PORT0_AVDD1V8
- VCC_1V1_NLDO
- VCC13
- NLDO2
  300mA max
- VDDA_DDR_PLL
- DDR_CH0_PLL_DVDD
- DDR_CH1_PLL_DVDD
- HDMI/EDP_TX0_VDD_0V75
- HDMI/EDP_TX0_AVDD_0V75
- PCIE30_PORT1_AVDD1V8
- NLDO3
  500mA max
- VDDA0V75_IMAGE
- HDMI/EDP_TX1_VDD_0V75
- HDMI/EDP_TX1_AVDD_0V75
- VCC14
- NLDO4
  500mA max
- VDDA_0V85
- TYPEC0_DP0_VDD_0V85
- TYPEC0_DP0_VDDA_0V85
- NLDO5
  300mA max
- VDDA_0V75
- USB20_DVDD_0V75
- OTP_VDDOTP_0V75
- TYPEC0_DP1_VDDA_0V85
- TYPEC0_DP1_VDD_0V85
- RK860-2 ,6A
- EN
- Seq:6A
- VDD_CPU_BIG0
- VDDCPU_BIG0
- VDDCPU_BIG0_MEM
- MIPI_CSI0_AVCC0V75
- MIPI_CSI1_AVCC0V75
- PCIE30_PORT0_AVDD0V75
- PCIE20_SATA30_0_AVDD_0V85
- PCIE20_SATA30_1_AVDD_0V85
- PCIE20_SATA30_USB30_2_AVDD_0V85
- RK860-3 ,6A
- VDD_CPU_BIG1
- VDDCPU_BIG1
- MIPI_D/C_PHY1_VDD
- PCIE30_PORT1_AVDD0V75
- VDDCPU_BIG1_MEM
- VDD_NPU
- VDD_NPU_MEM
- EXT DC/DC ,2A
- Seq:0A
- DC/DC , 2A(Option)
- DC/DC , 2A
- DP To HDMI(1.0V)
- MIPI To HDMI(1.2V)
- PMIC_EXT_EN_OUT
- LDO , 500mA
- VCC3V3_PI6C
- VDD1V2_SATAPM0/1

## Sheet 05.Power Sequence_IO Domain Map.SchDoc
size 420 x 297 mm; Revision: V2.1; Schematic Page Number: 11; Page Number: 6; Check: Default; Schematic Name: RK_NVR_DEMO1_RK3588_LP4/4x_V21; Page Count: 43; Page name: 05.Power Sequence/IO Domain Map; Designer: Zhangdz; Schematic Page Count: 99; Revcode: V2.1; DsnPath: E:\Work\SBER\RK3588_SOM\temp\RK_NVR_DEMO1_RK3588_LP4XD200P232SD8_V21_20211228.DSN; SchematicName: RK_NVR_DEMO1_RK3588_LP4/4x_V21; PageName: 05.Power Sequence/IO Domain Map; PageSize: A3; TopSchematic: True
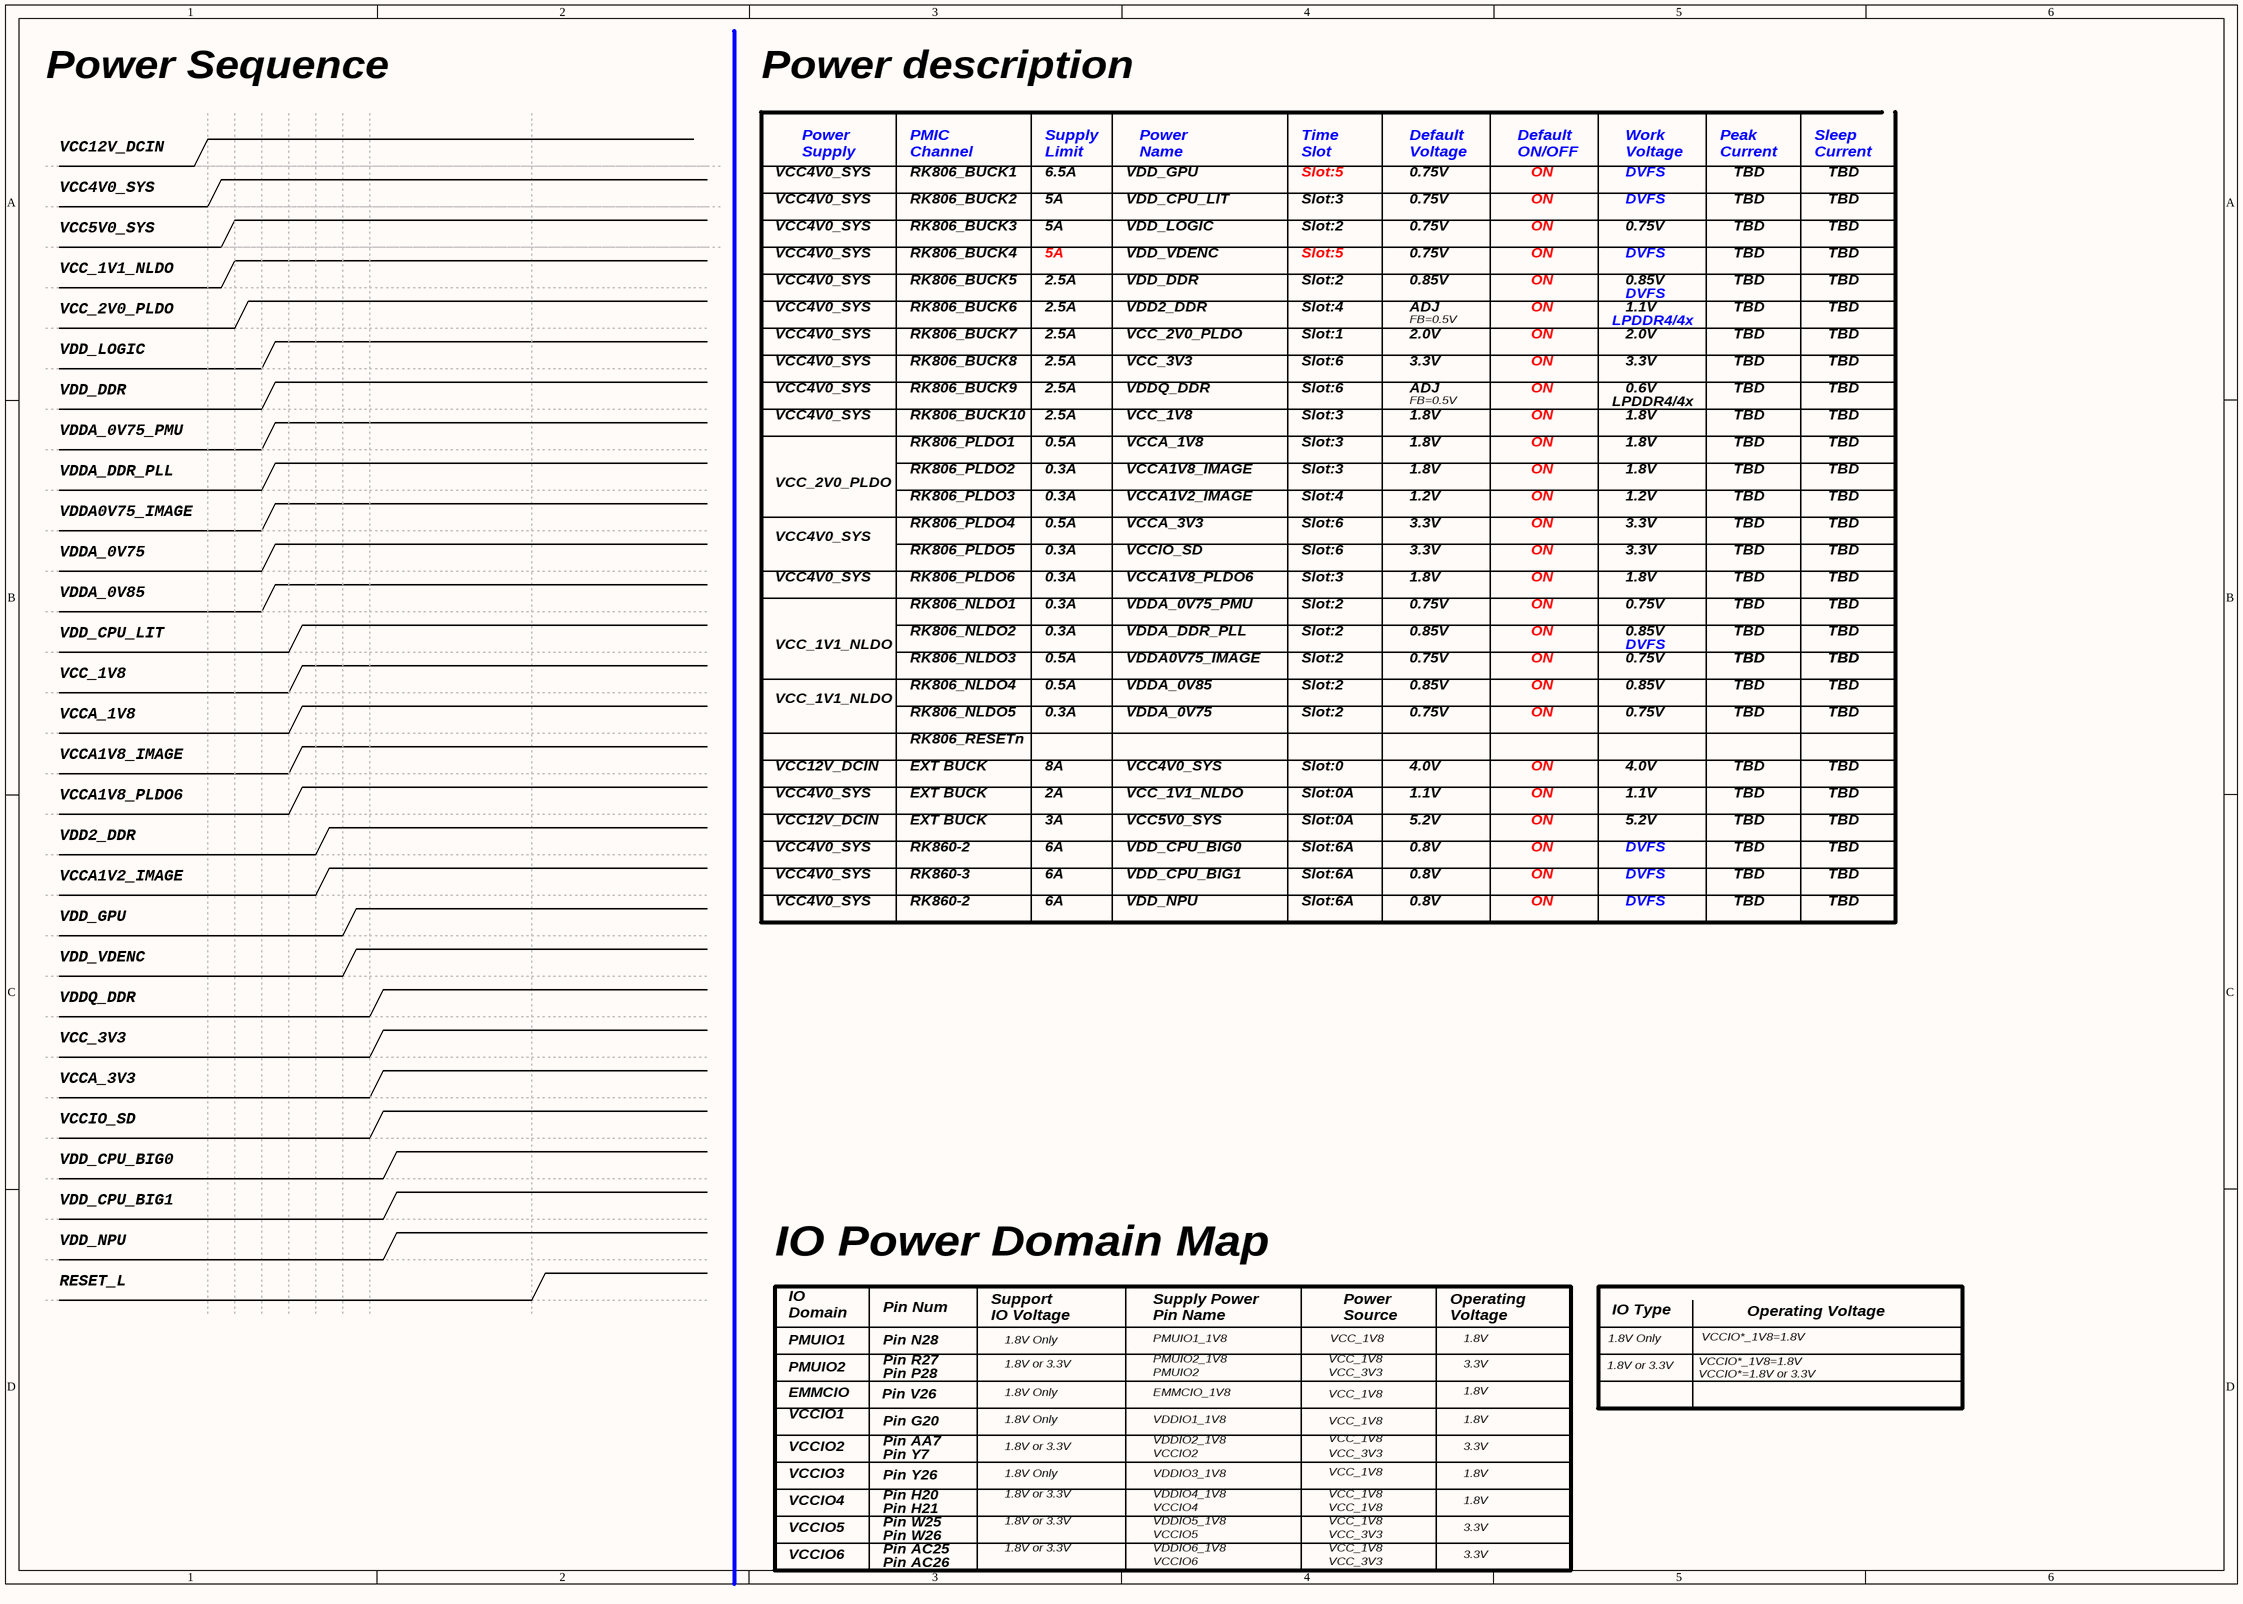
[diagram p11: 05.Power Sequence_IO Domain Map.SchDoc]

### Notes on the sheet
- Power Sequence
- Power description
- VCC4V0_SYS
- VCC12V_DCIN
- Power
  Supply
- PMIC
  Channel
- RK806_BUCK1
- Supply
  Limit
- 6.5A
- VDD_GPU
- Power
  Name
- Time
  Slot
- Slot:5
- Default
  Voltage
- 0.75V
- Default
  ON/OFF
- ON
- Work
  Voltage
- DVFS
- Peak
  Current
- TBD
- Sleep
  Current
- VCC5V0_SYS
- RK806_BUCK2
- RK806_BUCK3
- RK806_BUCK4
- 5A
- VDD_CPU_LIT
- VDD_LOGIC
- VDD_VDENC
- Slot:2
- Slot:3
- VCC_1V1_NLDO
- VCC_2V0_PLDO
- RK806_BUCK5
- RK806_BUCK6
- 2.5A
- VDD2_DDR
- VDD_DDR
- Slot:4
- 0.85V
- ADJ
- FB=0.5V
- LPDDR4/4x
- 1.1V
- RK806_BUCK7
- RK806_BUCK8
- RK806_BUCK9
- VCC_3V3
- VDDQ_DDR
- Slot:1
- Slot:6
- 2.0V
- 3.3V
- 0.6V
- VDDA_0V75_PMU
- RK806_BUCK10
- RK806_PLDO1
- 0.5A
- VCCA_1V8
- VCC_1V8
- 1.8V
- VDDA_DDR_PLL
- VDDA0V75_IMAGE
- RK806_PLDO2
- RK806_PLDO3
- RK806_PLDO4
- 0.3A
- VCCA1V2_IMAGE
- VCCA_3V3
- VCCA1V8_IMAGE
- 1.2V
- VDDA_0V75
- VDDA_0V85
- RK806_PLDO5
- RK806_PLDO6
- VCCA1V8_PLDO6
- VCCIO_SD
- RK806_NLDO3
- RK806_NLDO1
- RK806_NLDO2
- RK806_NLDO4
- RK806_NLDO5
- RK806_RESETn
- EXT BUCK
- 8A
- 2A
- Slot:0
- Slot:0A
- 4.0V
- RK860-2
- 3A
- 6A
- VDD_CPU_BIG0
- Slot:6A
- 5.2V
- 0.8V
- RK860-3
- VDD_CPU_BIG1
- VDD_NPU
- IO Power Domain Map
- RESET_L
- IO
  Domain
- Pin Num
- Support
  IO Voltage
- 1.8V Only
- Supply Power
  Pin Name
- PMUIO1_1V8
- Power
  Source
- Operating
  Voltage
- IO Type
- VCCIO*_1V8=1.8V
- Operating Voltage
- PMUIO1
- PMUIO2
- EMMCIO
- Pin V26
- Pin N28
- Pin R27
- Pin P28
- 1.8V or 3.3V
- PMUIO2_1V8
- EMMCIO_1V8
- VCCIO*_1V8=1.8V
  VCCIO*=1.8V or 3.3V
- VCCIO1
- VCCIO2
- VCCIO3
- Pin Y7
- Pin AA7
- Pin G20
- VDDIO1_1V8
- VDDIO2_1V8
- VDDIO3_1V8
- VCCIO4
- VCCIO5
- Pin Y26
- Pin H20
- Pin H21
- Pin W25
- Pin W26
- VDDIO4_1V8
- VDDIO5_1V8
- VCCIO6
- Pin AC25
- Pin AC26
- VDDIO6_1V8

## Sheet 06.Lower-Speed Bus Map.SchDoc
size 594 x 420 mm; Revision: V2.1; Schematic Page Number: 11; Page Number: 7; Check: <Checker>; Schematic Name: RK_NVR_DEMO1_RK3588_LP4/4x_V21; Page Count: 43; Page name: 06.Lower-Speed Bus Map; Designer: Zhangdz; Schematic Page Count: 99; Revcode: V2.1; DsnPath: E:\Work\SBER\RK3588_SOM\temp\RK_NVR_DEMO1_RK3588_LP4XD200P232SD8_V21_20211228.DSN; SchematicName: RK_NVR_DEMO1_RK3588_LP4/4x_V21; PageName: 06.Lower-Speed Bus Map; PageSize: A2; TopSchematic: True
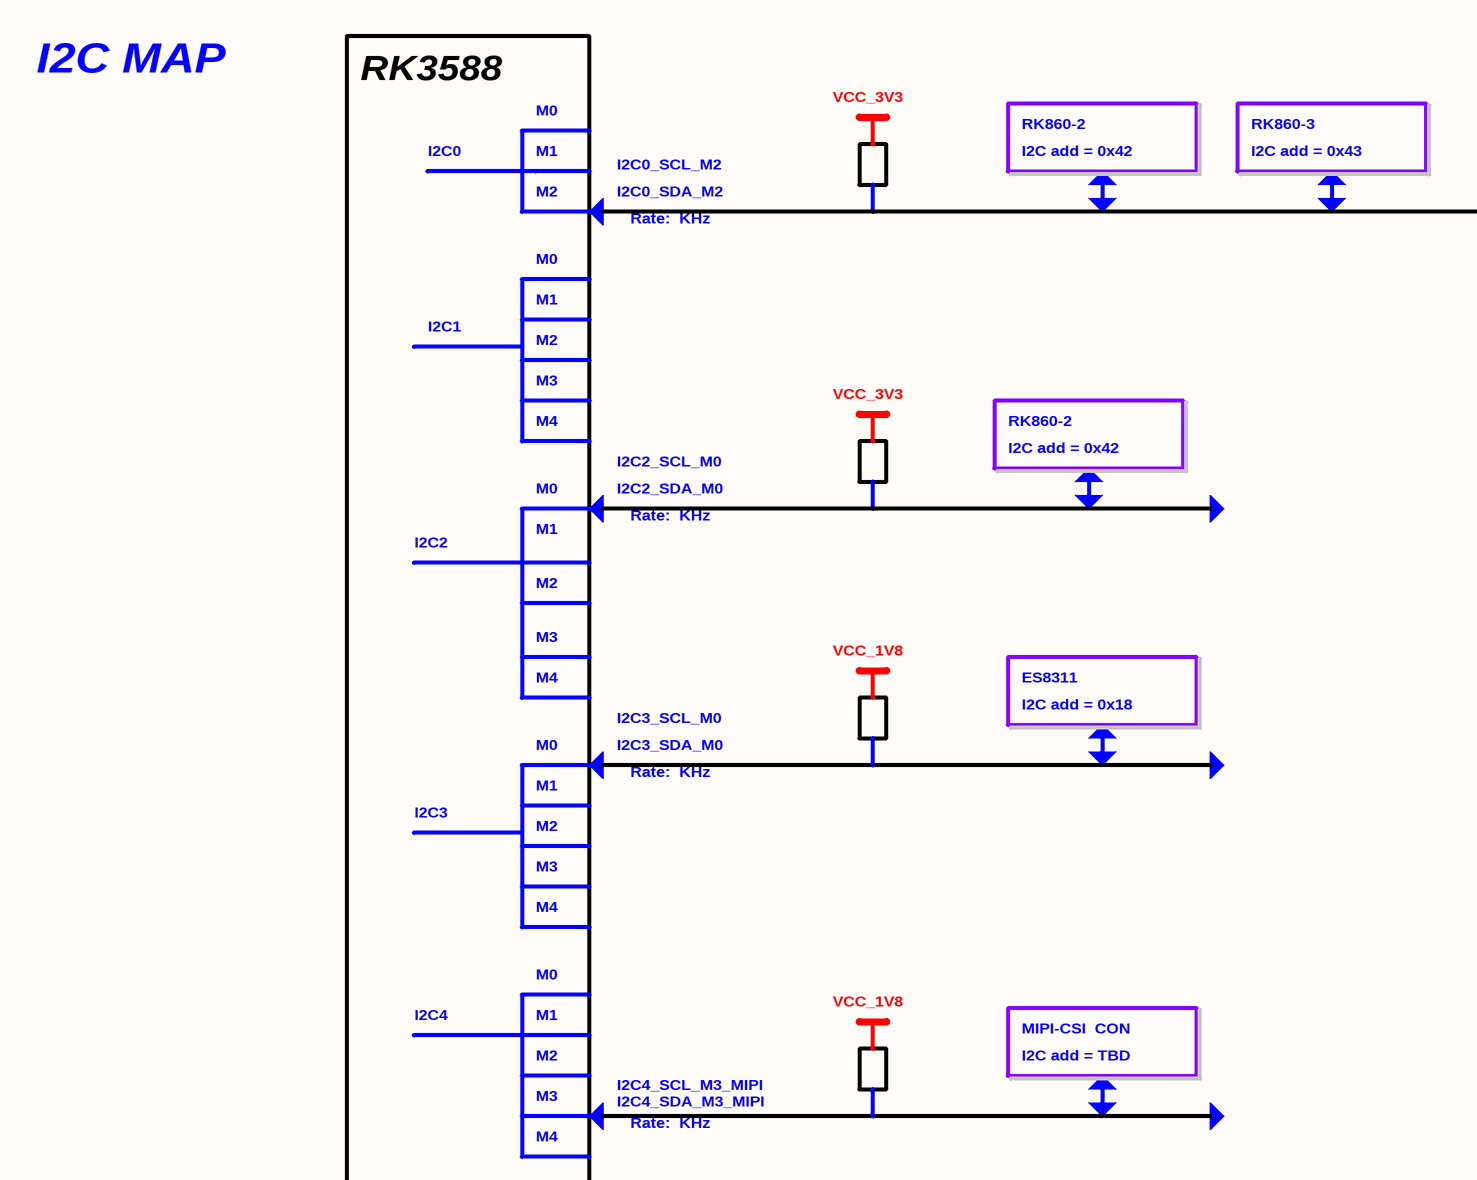
[diagram p12: 06.Lower-Speed Bus Map.SchDoc, top left]
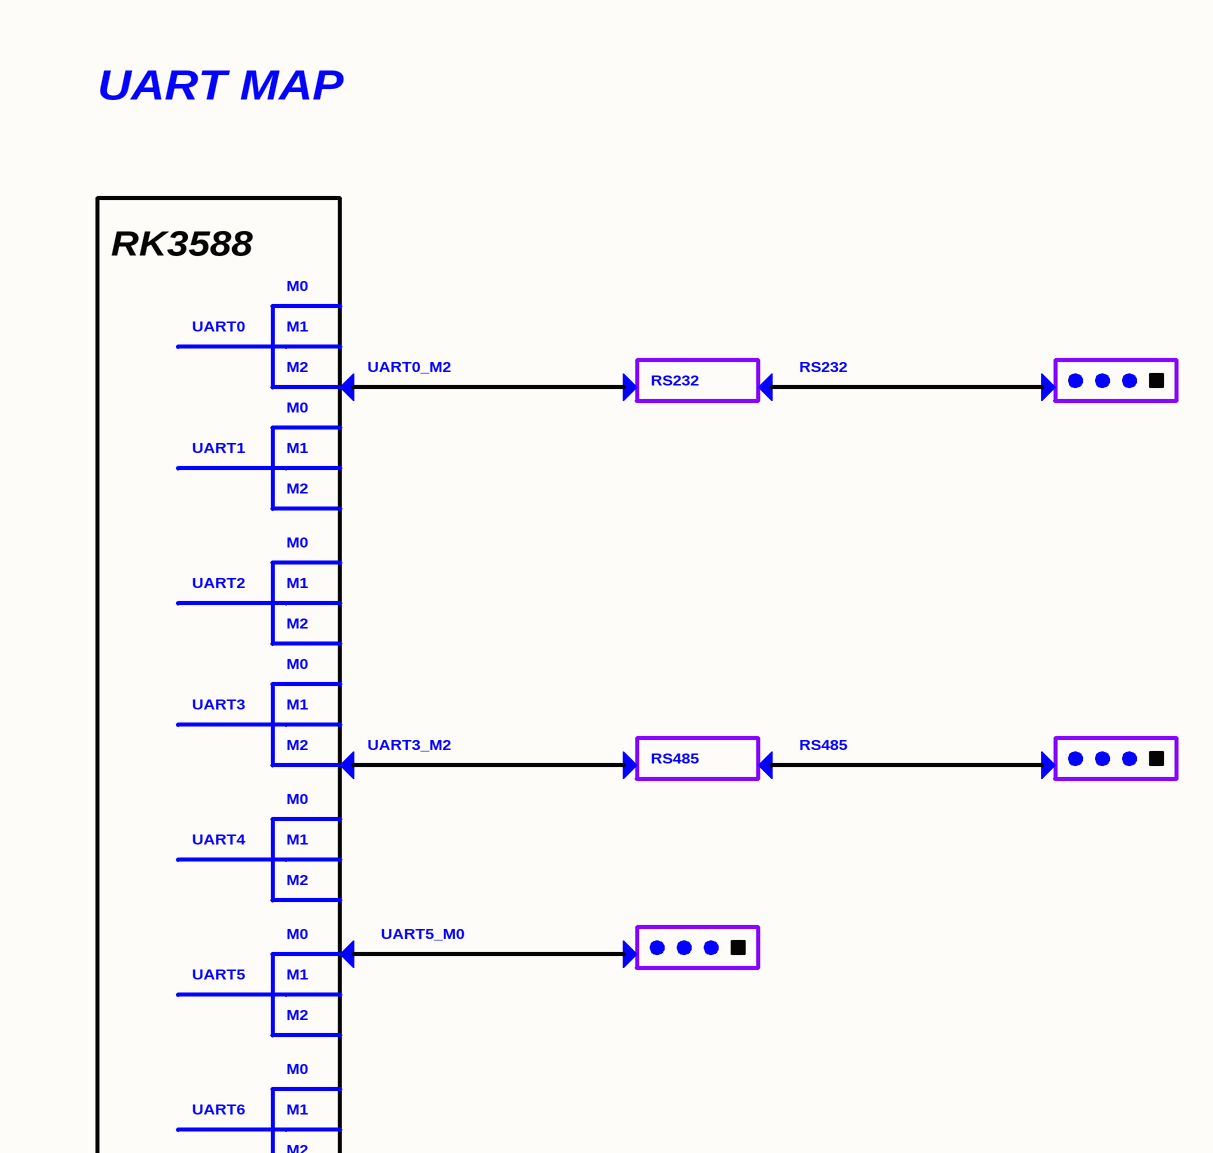
[diagram p13: 06.Lower-Speed Bus Map.SchDoc, top right]
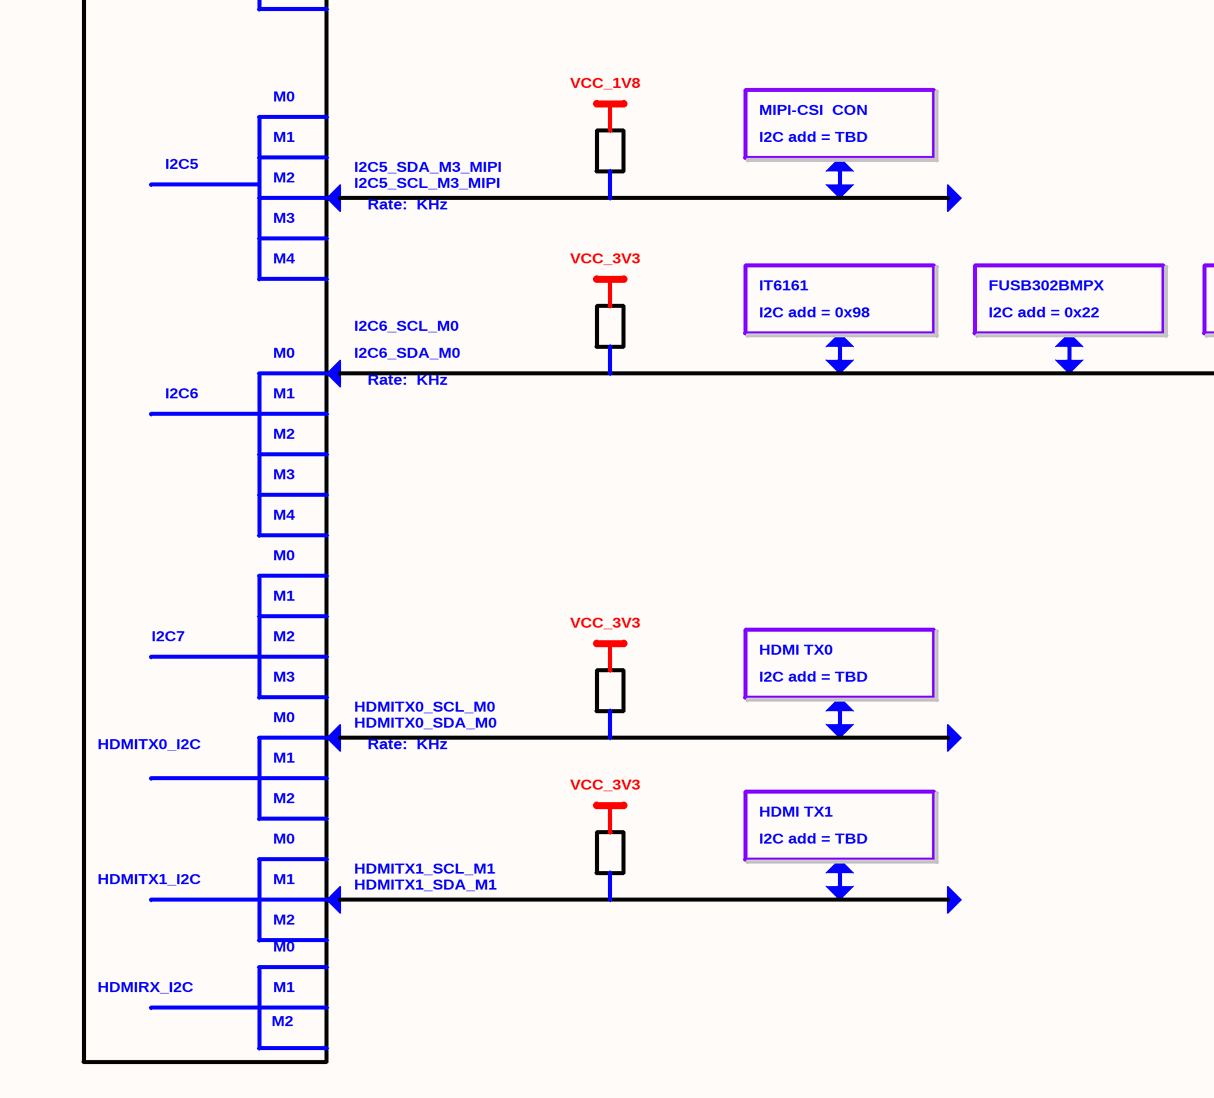
[diagram p14: 06.Lower-Speed Bus Map.SchDoc, bottom left]
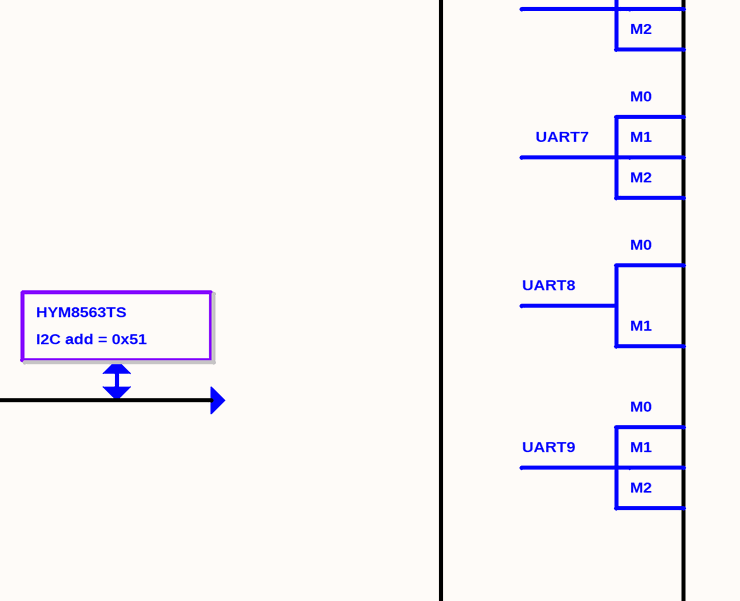
[diagram p15: 06.Lower-Speed Bus Map.SchDoc, bottom right]

### Notes on the sheet
- I2C MAP
- RK3588
- VCC_3V3
- UART MAP
- I2C0
- M1
- M0
- I2C0_SCL_M2
- RK860-2
- I2C add = 0x42
- RK860-3
- I2C add = 0x43
- M2
- I2C0_SDA_M2
- Rate:  KHz
- I2C1
- UART0
- UART0_M2
- RS232
- M3
- M4
- I2C2_SCL_M0
- I2C2_SDA_M0
- UART1
- I2C2
- UART2
- VCC_1V8
- ES8311
- I2C add = 0x18
- UART3
- I2C3_SDA_M0
- I2C3_SCL_M0
- UART3_M2
- RS485
- I2C3
- UART4
- UART5
- UART5_M0
- I2C4
- MIPI-CSI  CON
- I2C4_SCL_M3_MIPI
  I2C4_SDA_M3_MIPI
- I2C add = TBD
- UART6
- I2C5
- UART7
- I2C5_SDA_M3_MIPI
  I2C5_SCL_M3_MIPI
- IT6161
- FUSB302BMPX
- HYM8563TS
- UART8
- I2C6_SDA_M0
- I2C6_SCL_M0
- I2C add = 0x98
- I2C add = 0x22
- I2C add = 0x51
- I2C6
- UART9
- I2C7
- HDMI TX0
- HDMITX0_I2C
- HDMITX0_SCL_M0
  HDMITX0_SDA_M0
- HDMI TX1
- HDMITX1_I2C
- HDMITX1_SCL_M1
  HDMITX1_SDA_M1
- HDMIRX_I2C

## Sheet 07.USB_DP Configure Map.SchDoc
size 840 x 594 mm; Revision: V2.1; Schematic Page Number: 11; Page Number: 8; Check: <Checker>; Schematic Name: RK_NVR_DEMO1_RK3588_LP4/4x_V21; Page Count: 43; Page name: 07.USB/DP Configure Map; Designer: Zhangdz; Schematic Page Count: 99; Revcode: V2.1; DsnPath: E:\Work\SBER\RK3588_SOM\temp\RK_NVR_DEMO1_RK3588_LP4XD200P232SD8_V21_20211228.DSN; SchematicName: RK_NVR_DEMO1_RK3588_LP4/4x_V21; PageName: 07.USB/DP Configure Map; PageSize: A1; TopSchematic: True
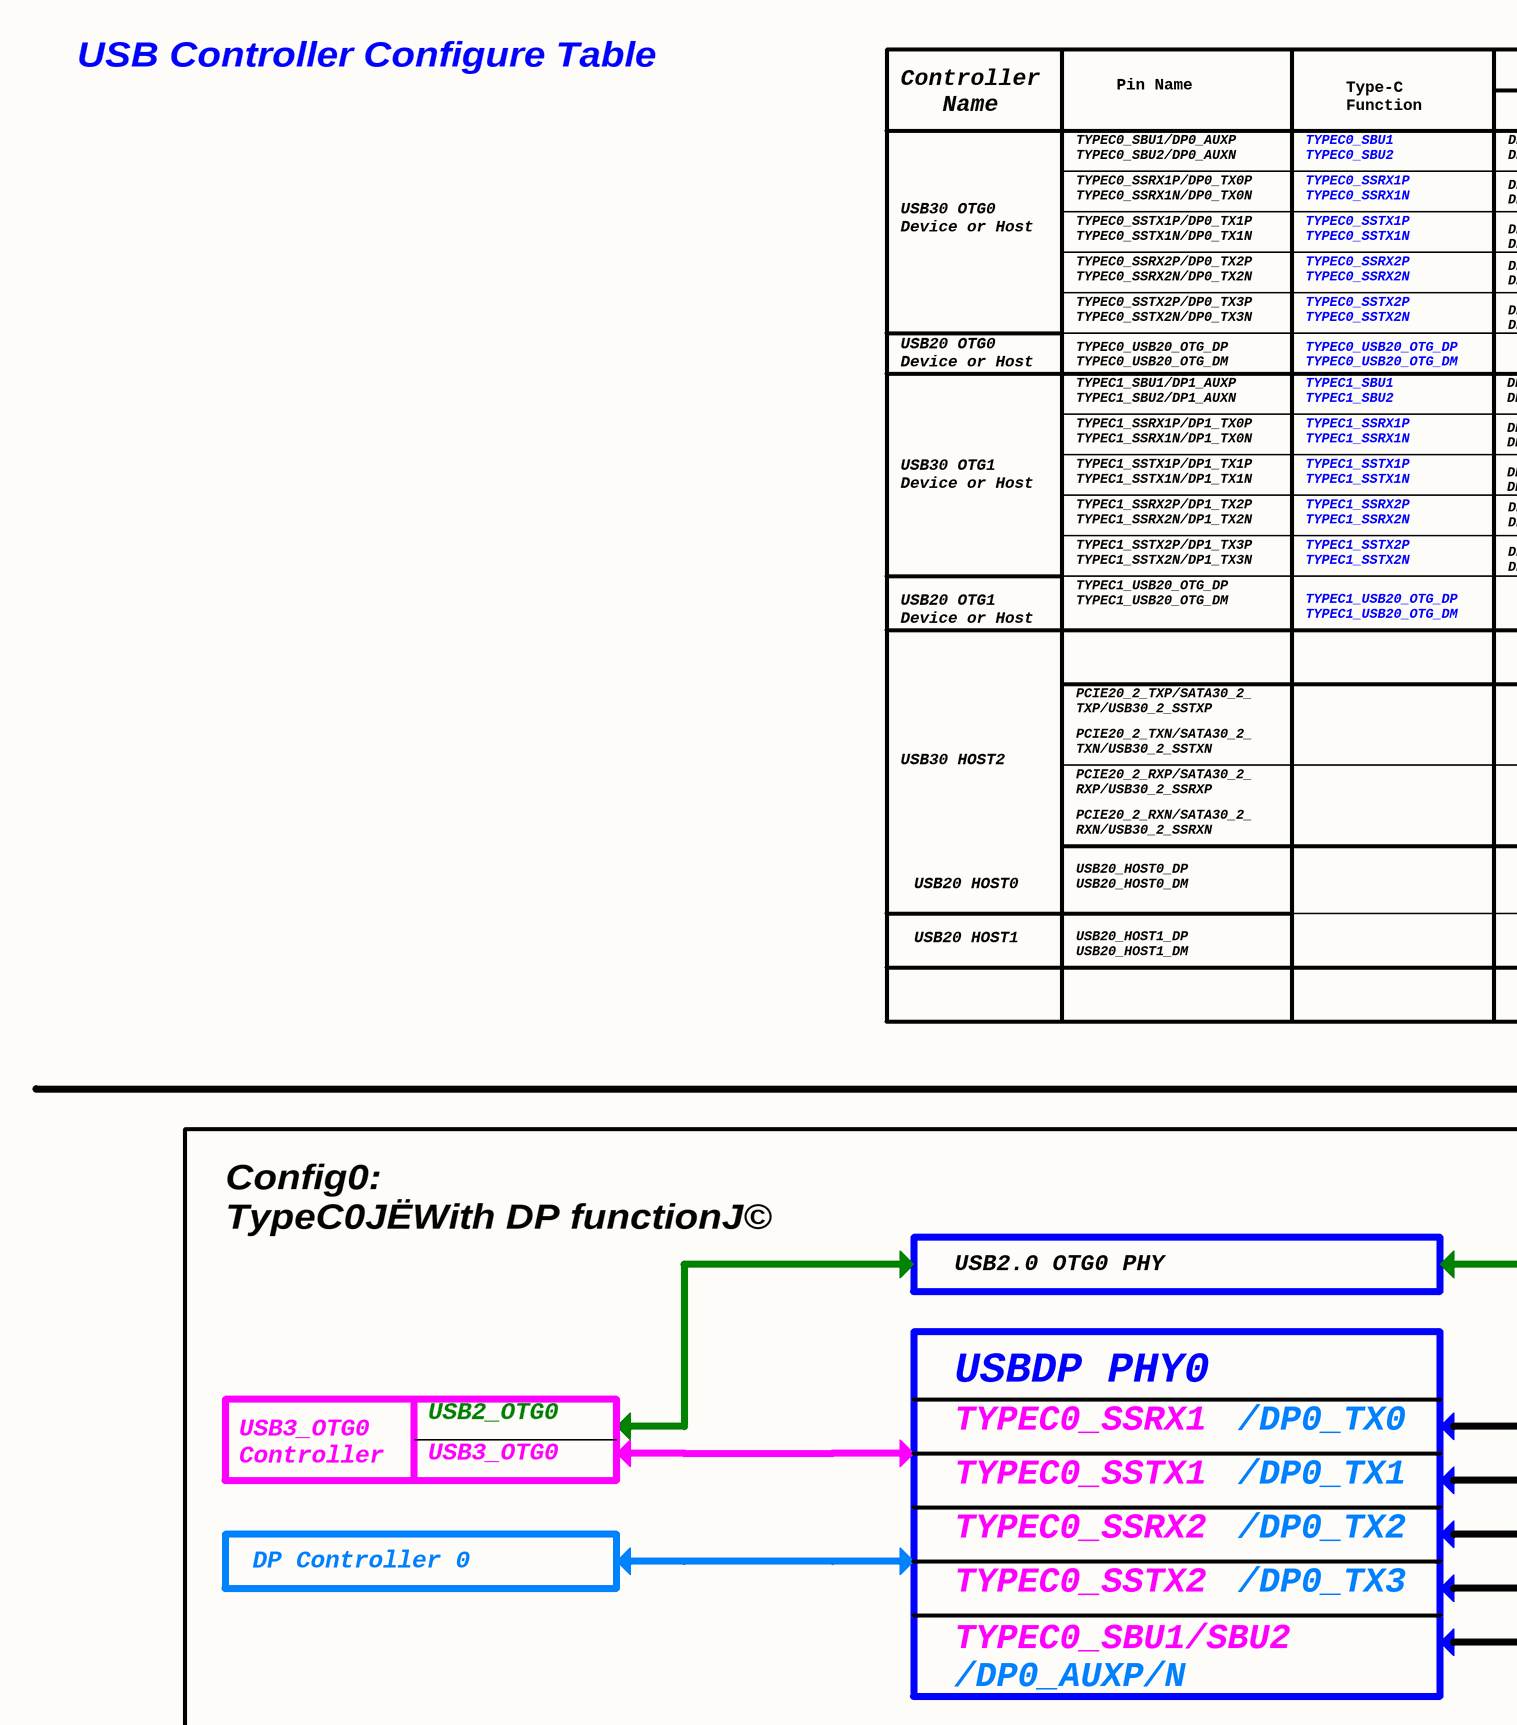
[diagram p16: 07.USB_DP Configure Map.SchDoc, top left]
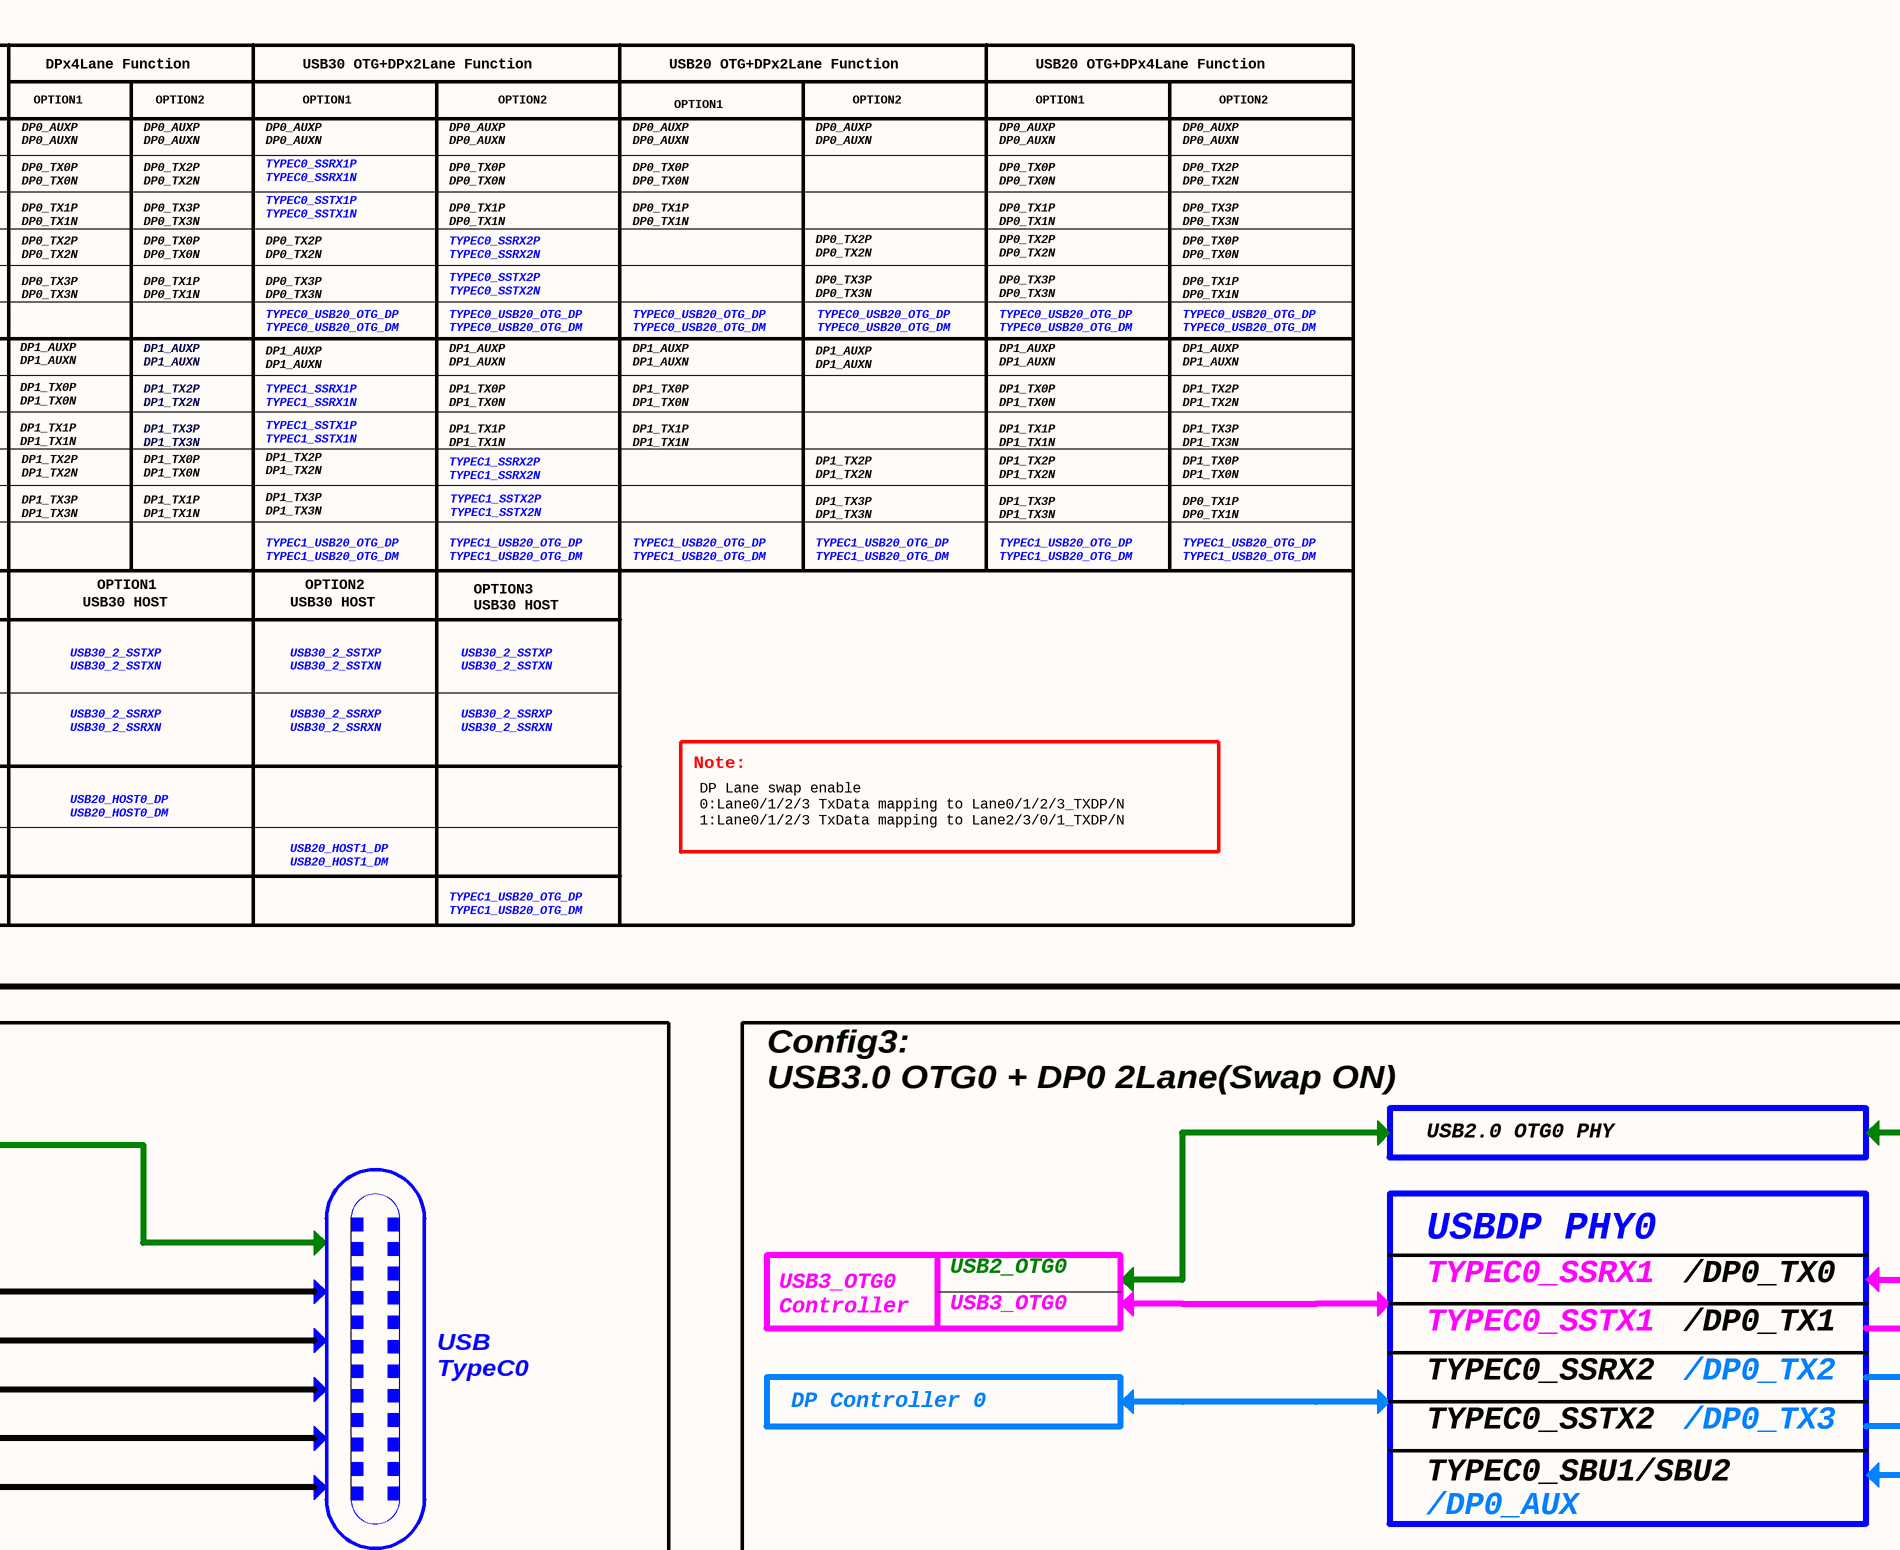
[diagram p17: 07.USB_DP Configure Map.SchDoc, top middle]
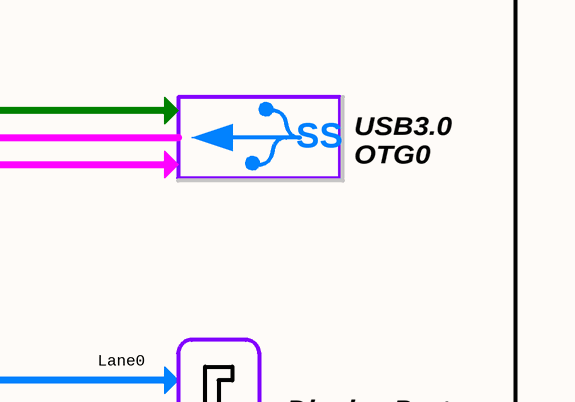
[diagram p18: 07.USB_DP Configure Map.SchDoc, top right]
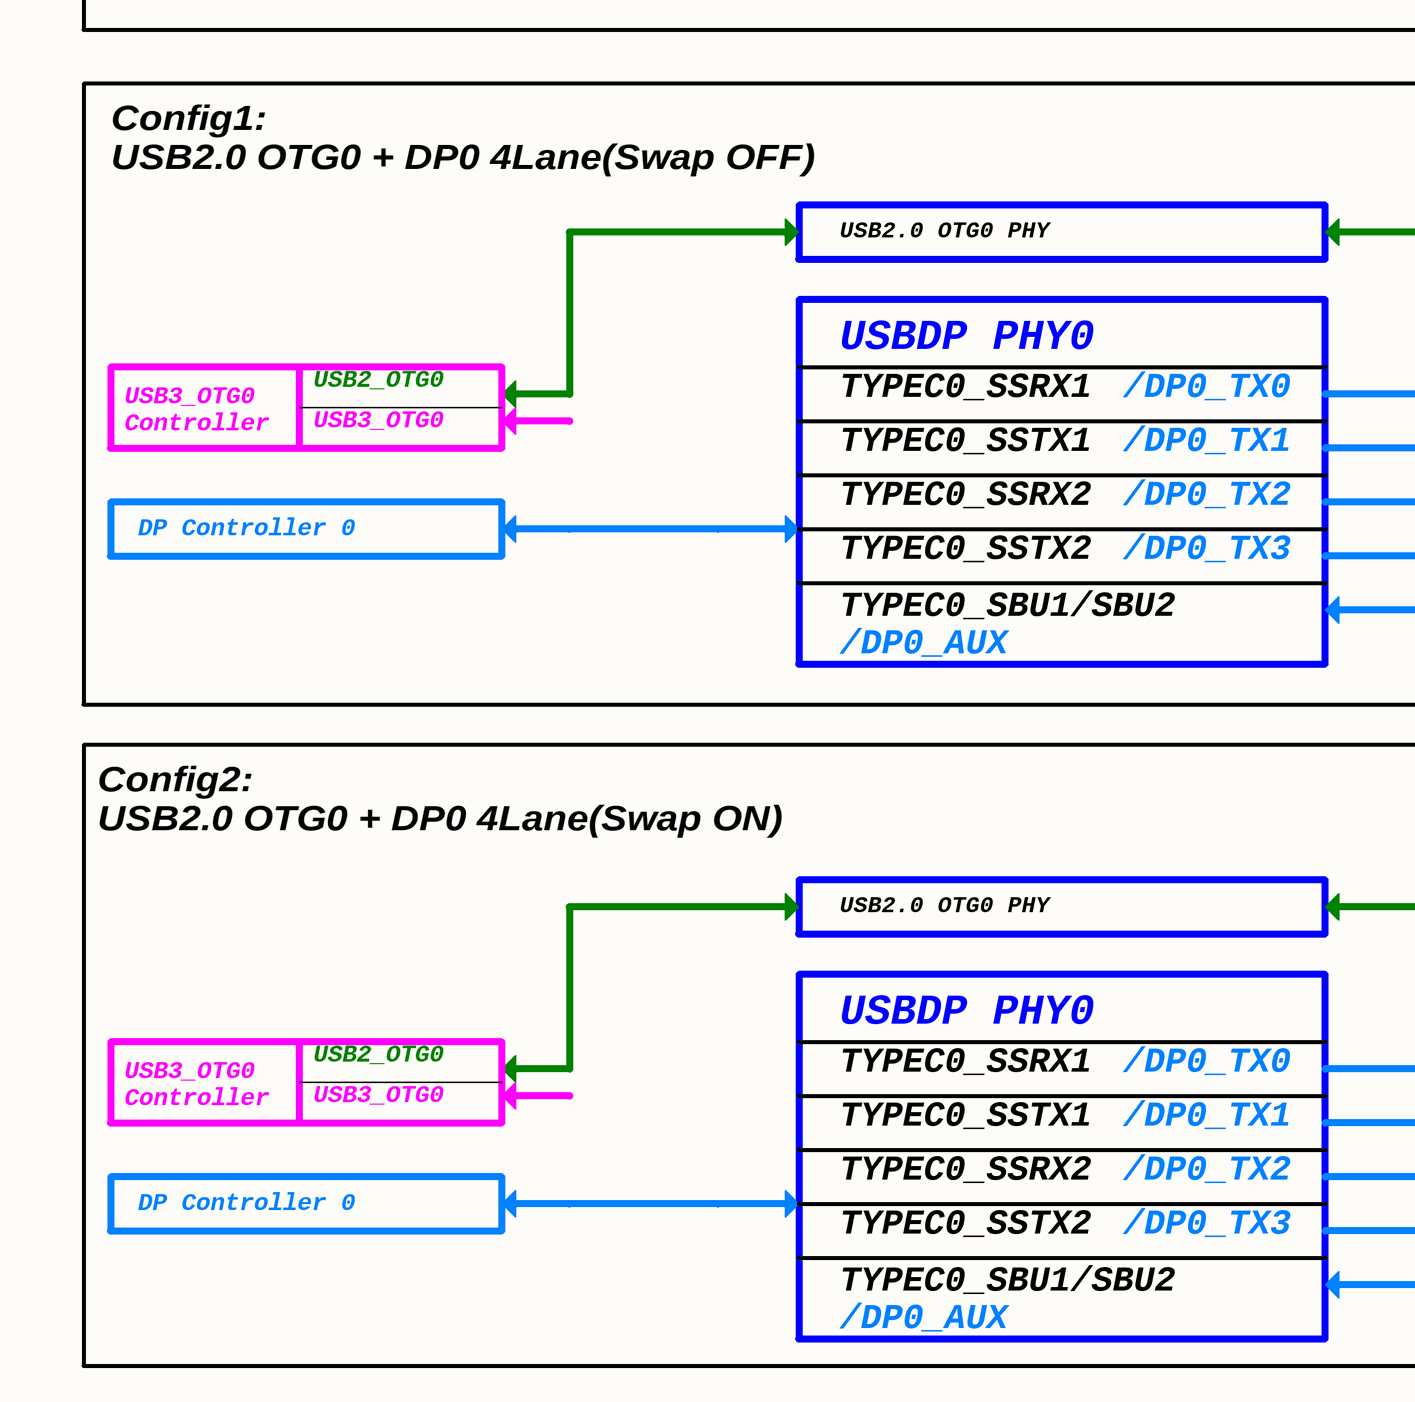
[diagram p19: 07.USB_DP Configure Map.SchDoc, bottom left]
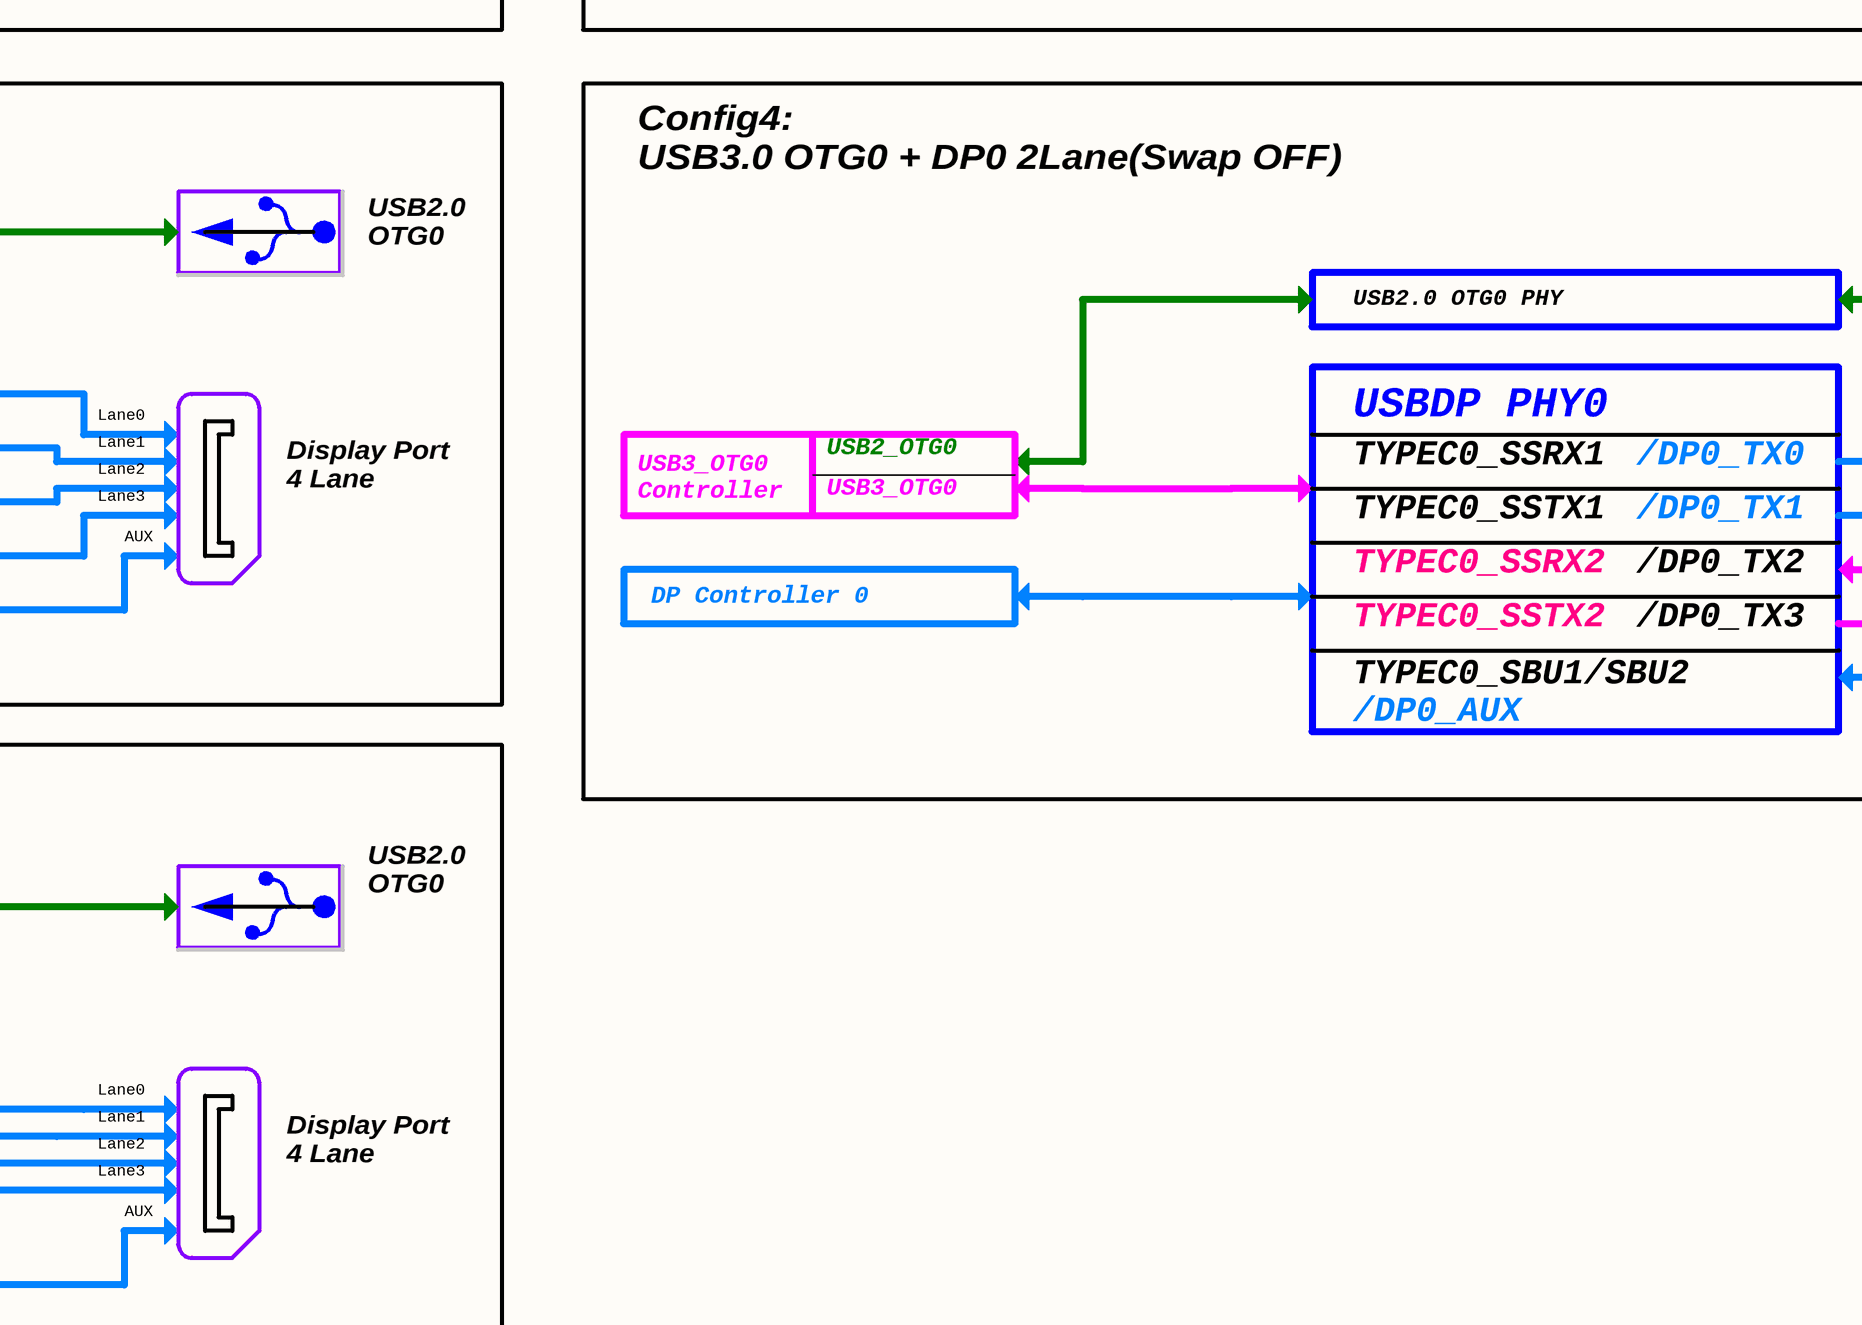
[diagram p20: 07.USB_DP Configure Map.SchDoc, bottom middle]
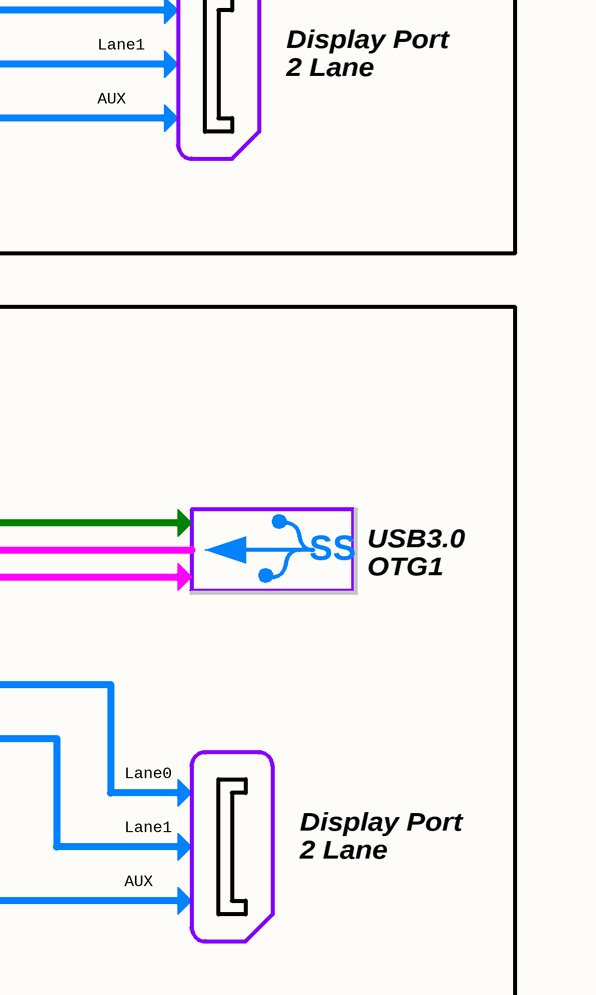
[diagram p21: 07.USB_DP Configure Map.SchDoc, bottom right]

### Notes on the sheet
- USB Controller Configure Table
- Controller
  Name
- Pin Name
- Type-C
  Function
- OPTION1
- DPx4Lane Function
- OPTION2
- USB30 OTG+DPx2Lane Function
- USB20 OTG+DPx2Lane Function
- USB20 OTG+DPx4Lane Function
- TYPEC0_SBU1/DP0_AUXP
  TYPEC0_SBU2/DP0_AUXN
- TYPEC0_SSRX1P/DP0_TX0P
  TYPEC0_SSRX1N/DP0_TX0N
- TYPEC0_SBU1
  TYPEC0_SBU2
- TYPEC0_SSRX1P
  TYPEC0_SSRX1N
- DP0_AUXP
  DP0_AUXN
- USB30 OTG0
  Device or Host
- TYPEC0_SSTX1P/DP0_TX1P
  TYPEC0_SSTX1N/DP0_TX1N
- TYPEC0_SSTX1P
  TYPEC0_SSTX1N
- DP0_AUXP
  DP0_AUXN
  DP0_TX0P
  DP0_TX0N
  DP0_TX1P
  DP0_TX1N
- DP0_AUXP
  DP0_AUXN
  DP0_TX2P
  DP0_TX2N
  DP0_TX3P
  DP0_TX3N
- TYPEC0_SSRX2P/DP0_TX2P
  TYPEC0_SSRX2N/DP0_TX2N
- TYPEC0_SSTX2P/DP0_TX3P
  TYPEC0_SSTX2N/DP0_TX3N
- TYPEC0_SSRX2P
  TYPEC0_SSRX2N
- TYPEC0_SSTX2P
  TYPEC0_SSTX2N
- DP0_TX2P
  DP0_TX2N
  DP0_TX3P
  DP0_TX3N
- DP0_TX0P
  DP0_TX0N
  DP0_TX1P
  DP0_TX1N
- USB20 OTG0
  Device or Host
- TYPEC1_SBU1/DP1_AUXP
  TYPEC1_SBU2/DP1_AUXN
- TYPEC0_USB20_OTG_DP
  TYPEC0_USB20_OTG_DM
- TYPEC1_SBU1
  TYPEC1_SBU2
- TYPEC1_SSRX1P/DP1_TX0P
  TYPEC1_SSRX1N/DP1_TX0N
- TYPEC1_SSRX1P
  TYPEC1_SSRX1N
- DP1_AUXP
  DP1_AUXN
- USB30 OTG1
  Device or Host
- TYPEC1_SSTX1P/DP1_TX1P
  TYPEC1_SSTX1N/DP1_TX1N
- TYPEC1_SSRX2P/DP1_TX2P
  TYPEC1_SSRX2N/DP1_TX2N
- TYPEC1_SSTX1P
  TYPEC1_SSTX1N
- TYPEC1_SSRX2P
  TYPEC1_SSRX2N
- DP1_AUXP
  DP1_AUXN
  DP1_TX0P
  DP1_TX0N
  DP1_TX1P
  DP1_TX1N
- DP1_AUXP
  DP1_AUXN
  DP1_TX2P
  DP1_TX2N
  DP1_TX3P
  DP1_TX3N
- TYPEC1_USB20_OTG_DP
  TYPEC1_USB20_OTG_DM
- TYPEC1_SSTX2P/DP1_TX3P
  TYPEC1_SSTX2N/DP1_TX3N
- TYPEC1_SSTX2P
  TYPEC1_SSTX2N
- DP1_TX2P
  DP1_TX2N
  DP1_TX3P
  DP1_TX3N
- DP1_TX0P
  DP1_TX0N
  DP1_TX1P
  DP1_TX1N
- DP1_TX0P
  DP1_TX0N
  DP0_TX1P
  DP0_TX1N
- USB20 OTG1
  Device or Host
- USB30 HOST
- OPTION3
  USB30 HOST
- PCIE20_2_TXP/SATA30_2_
  TXP/USB30_2_SSTXP
- USB30_2_SSTXP
  USB30_2_SSTXN
- USB30 HOST2
- PCIE20_2_TXN/SATA30_2_
  TXN/USB30_2_SSTXN
- PCIE20_2_RXP/SATA30_2_
  RXP/USB30_2_SSRXP
- USB30_2_SSRXP
  USB30_2_SSRXN
- PCIE20_2_RXN/SATA30_2_
  RXN/USB30_2_SSRXN
- Note:
- USB20 HOST0
- USB20 HOST1
- USB20_HOST0_DP
  USB20_HOST0_DM
- DP Lane swap enable
  0:Lane0/1/2/3 TxData mapping to Lane0/1/2/3_TXDP/N
  1:Lane0/1/2/3 TxData mapping to Lane2/3/0/1_TXDP/N
- USB20_HOST1_DP
  USB20_HOST1_DM
- Config3:
  USB3.0 OTG0 + DP0 2Lane(Swap ON)
- Config0:
  TypeC0ЈЁWith DP functionЈ©
- USB2.0 OTG0 PHY
- SS
- USB3.0
  OTG0
- USBDP PHY0
- USB2_OTG0
- USB3_OTG0
  Controller
- USB3_OTG0
- TYPEC0_SSRX1
- /DP0_TX0
- TYPEC0_SSTX1
- /DP0_TX1
- TYPEC0_SSRX2
- /DP0_TX2
- USB
  TypeC0
- Lane0
- DP Controller 0
- TYPEC0_SSTX2
- /DP0_TX3
- Lane1
- AUX
- Display Port
  2 Lane
- TYPEC0_SBU1/SBU2
- /DP0_AUX
- /DP0_AUXP/N
- Config1:
  USB2.0 OTG0 + DP0 4Lane(Swap OFF)
- Config4:
  USB3.0 OTG0 + DP0 2Lane(Swap OFF)
- USB2.0
  OTG0
- USB3.0
  OTG1
- Lane2
- Display Port
  4 Lane
- Lane3
- Config2:
  USB2.0 OTG0 + DP0 4Lane(Swap ON)